# EasyEDA Pro project PCB_SCH_Right_Main.epro

# Schematic right_mains

## Sheets
1 led and buttons: Board Name: right_mains; Create Date: 2025-10-24; Page Name: led and buttons; Project Name: SCH_right_mains; Schematic Name: right_mains; Update Date: 2025-10-23; Add into BOM: yes; Company: Your Company; Convert to PCB: yes; Date: 10/24/2025; Draw By: Habana; REV: 1.0; Sheet: 1/1; spicePre: .
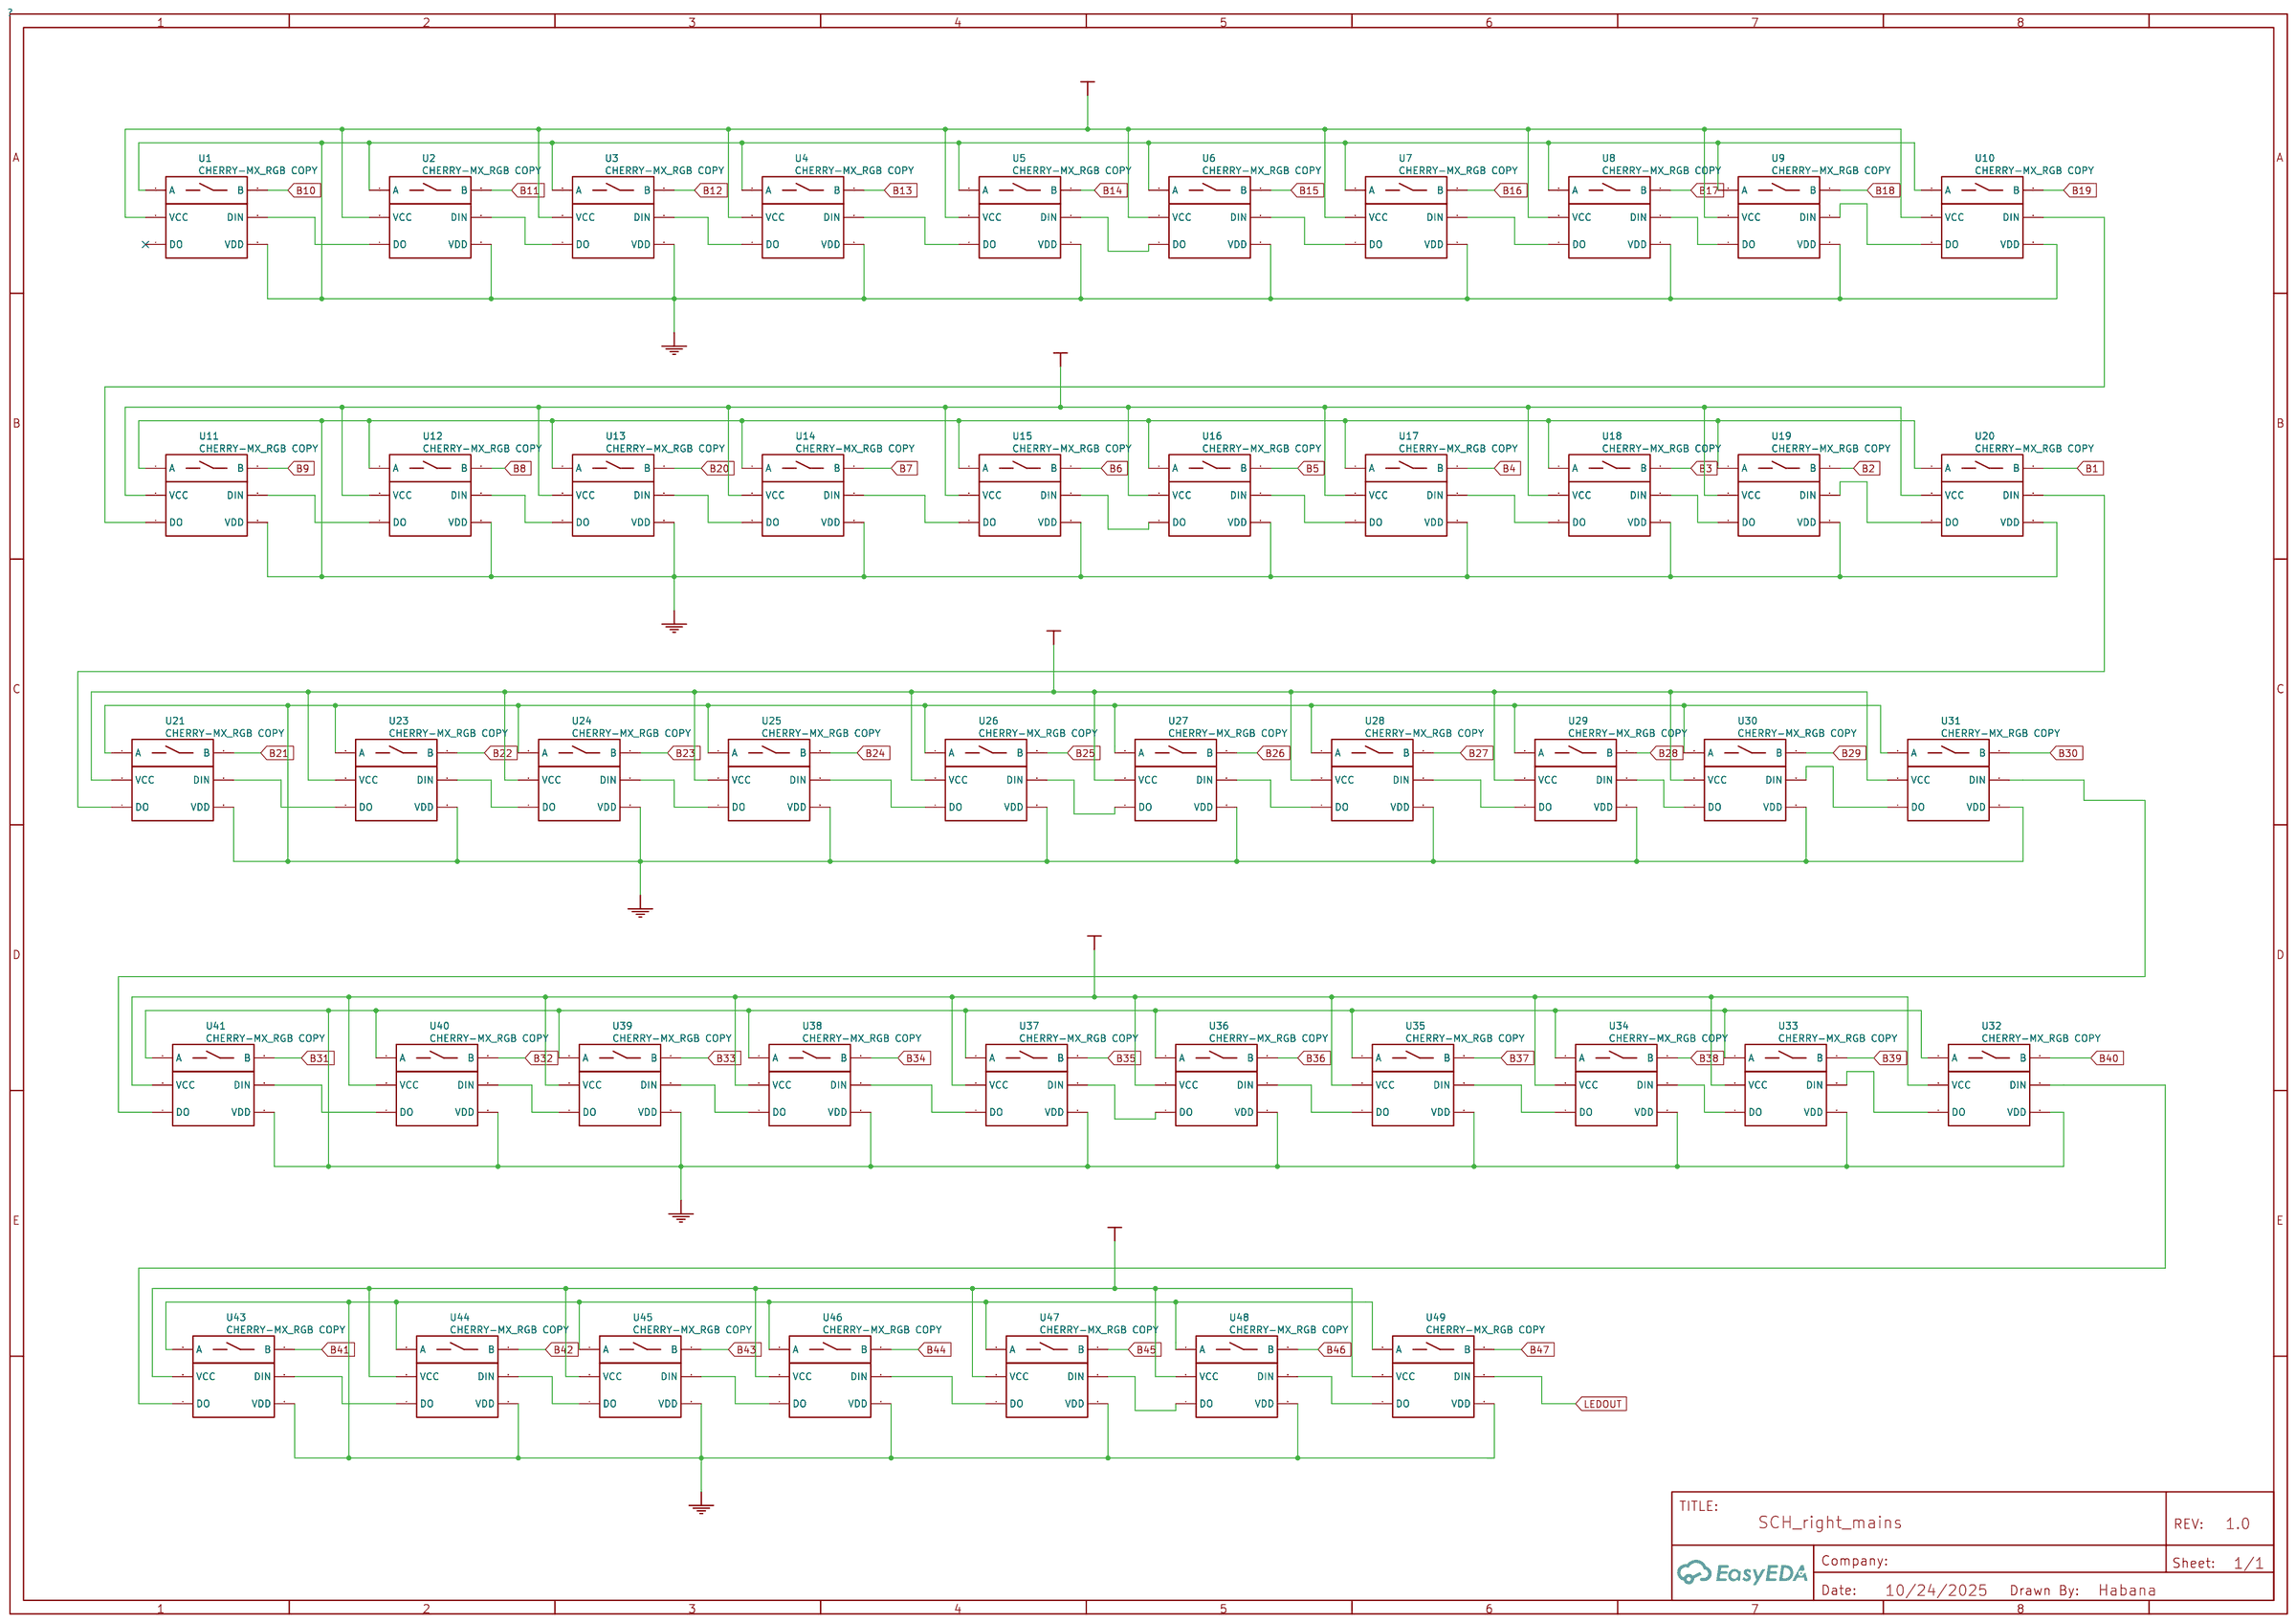
[diagram p0: led and buttons]
2 drivers: Page Name: drivers
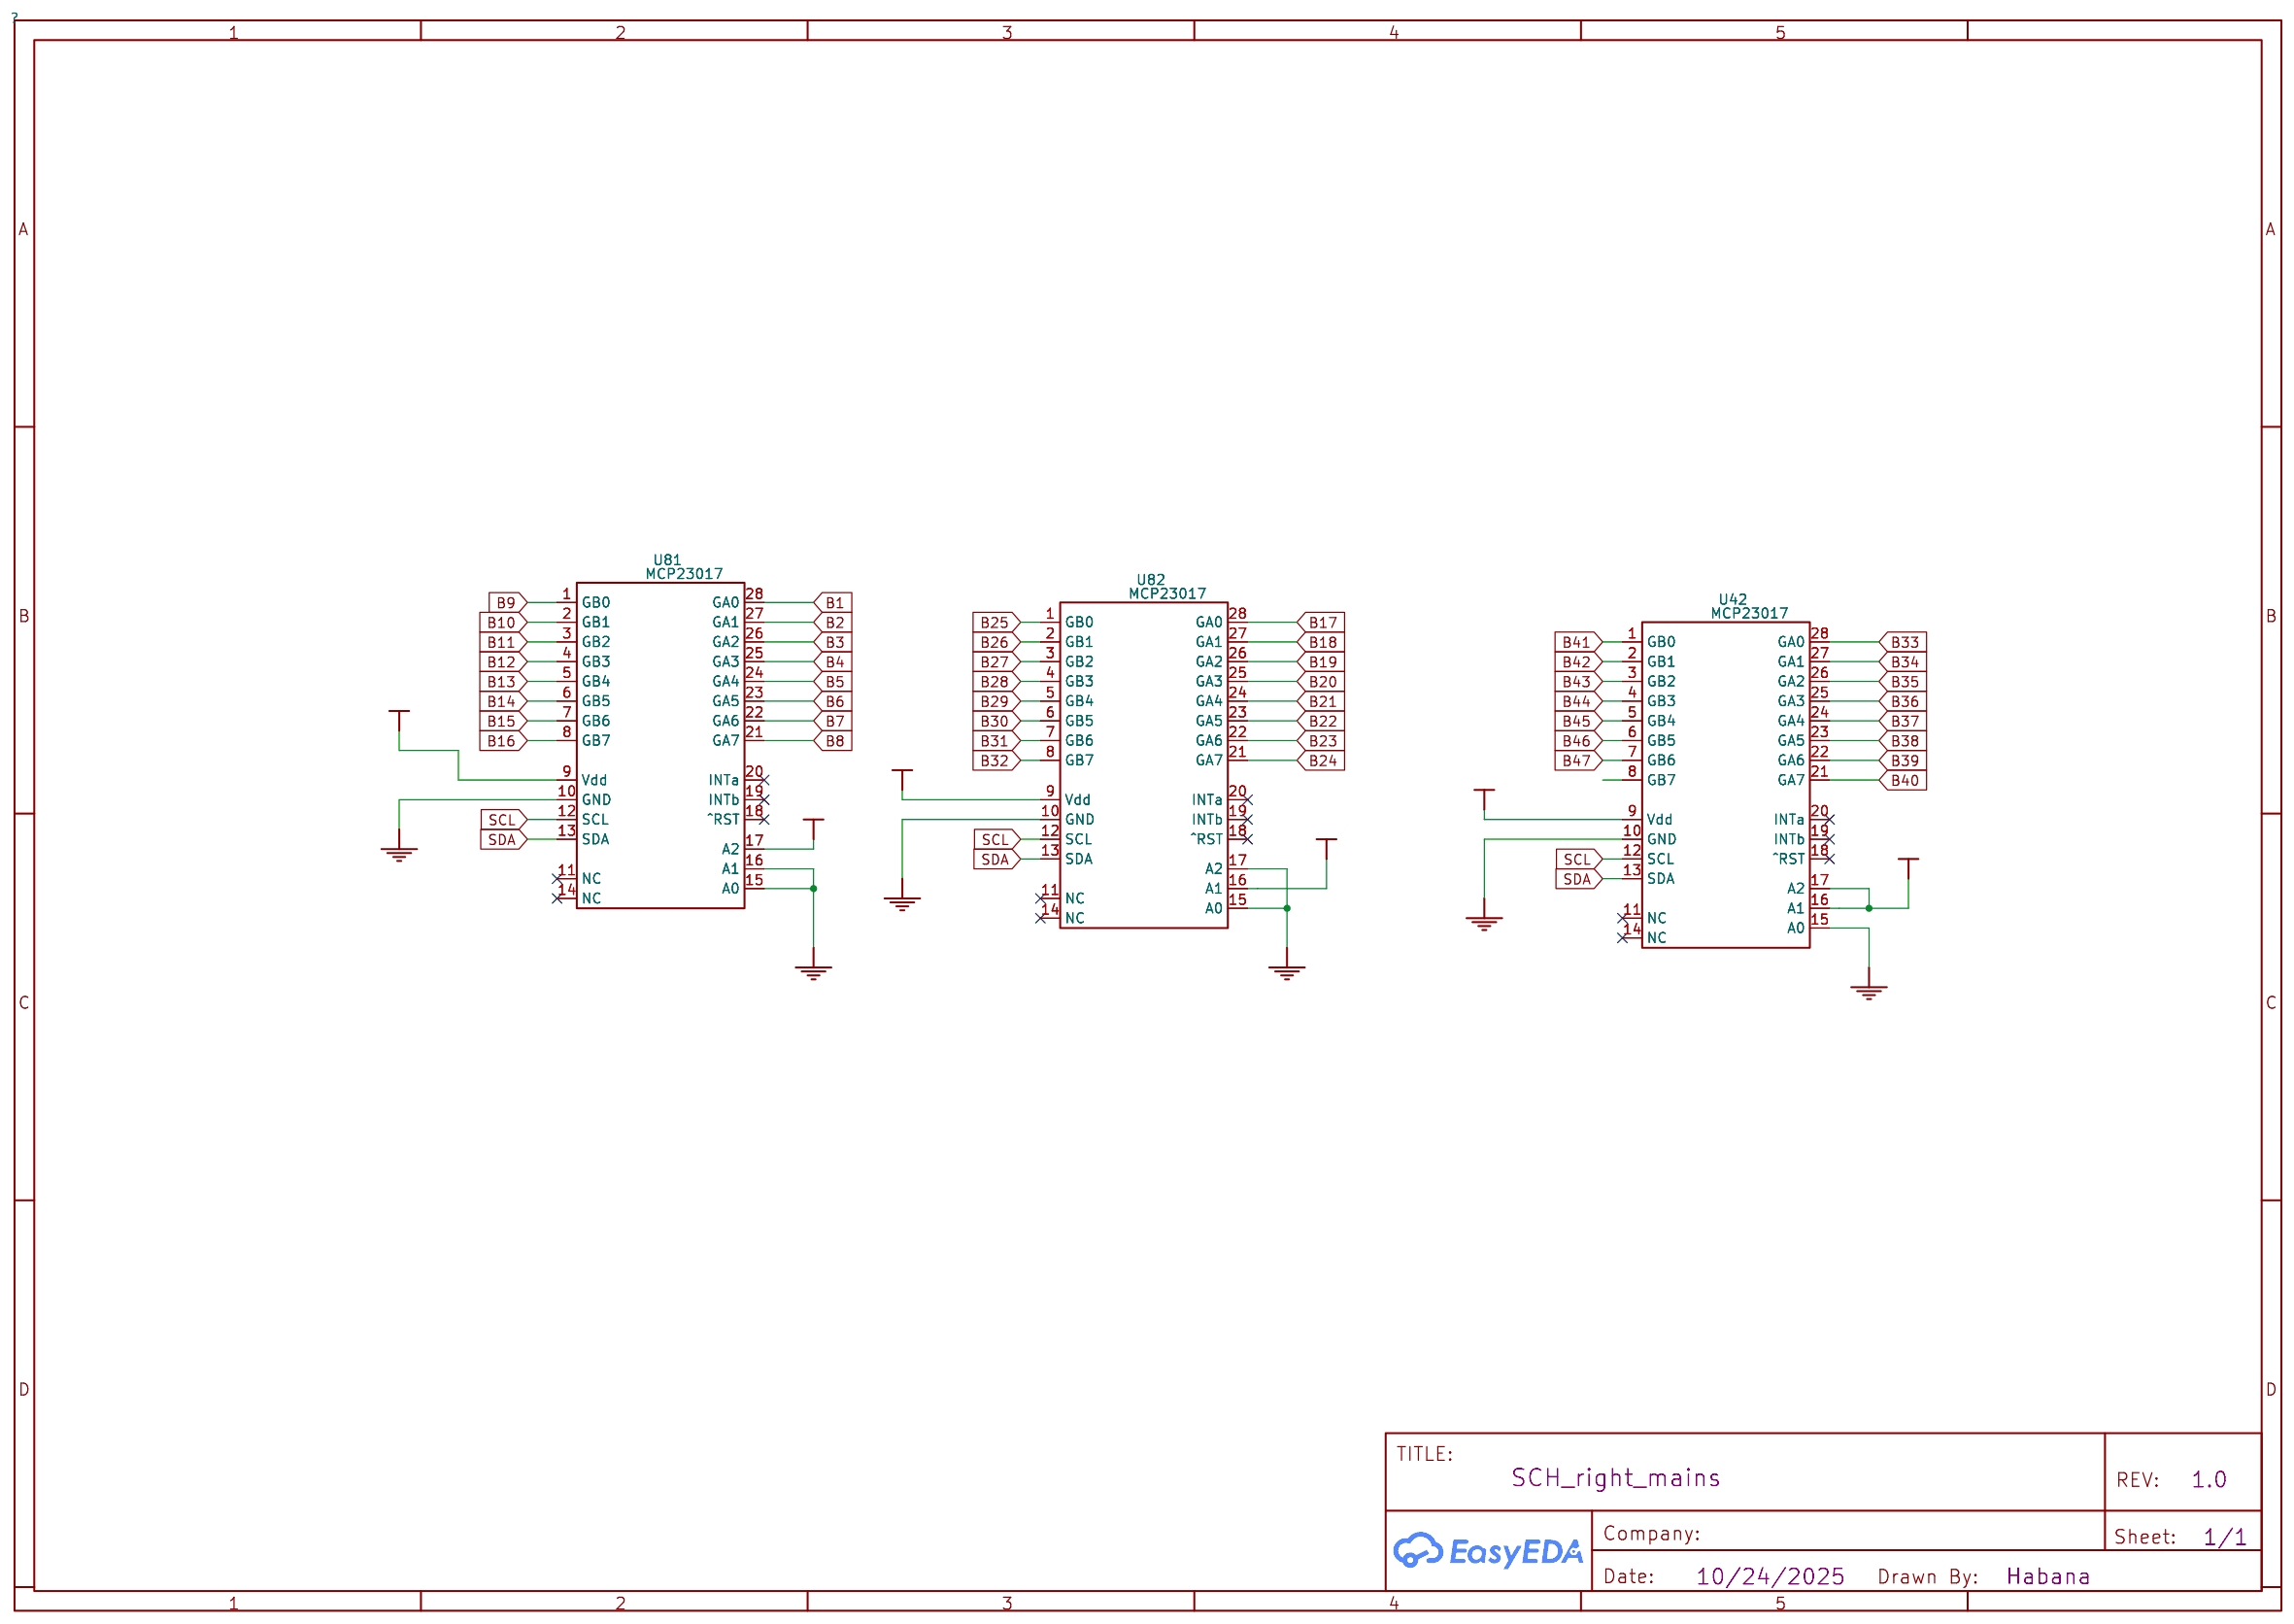
[diagram p1: drivers]
3 micro_controller: Page Name: micro_controller
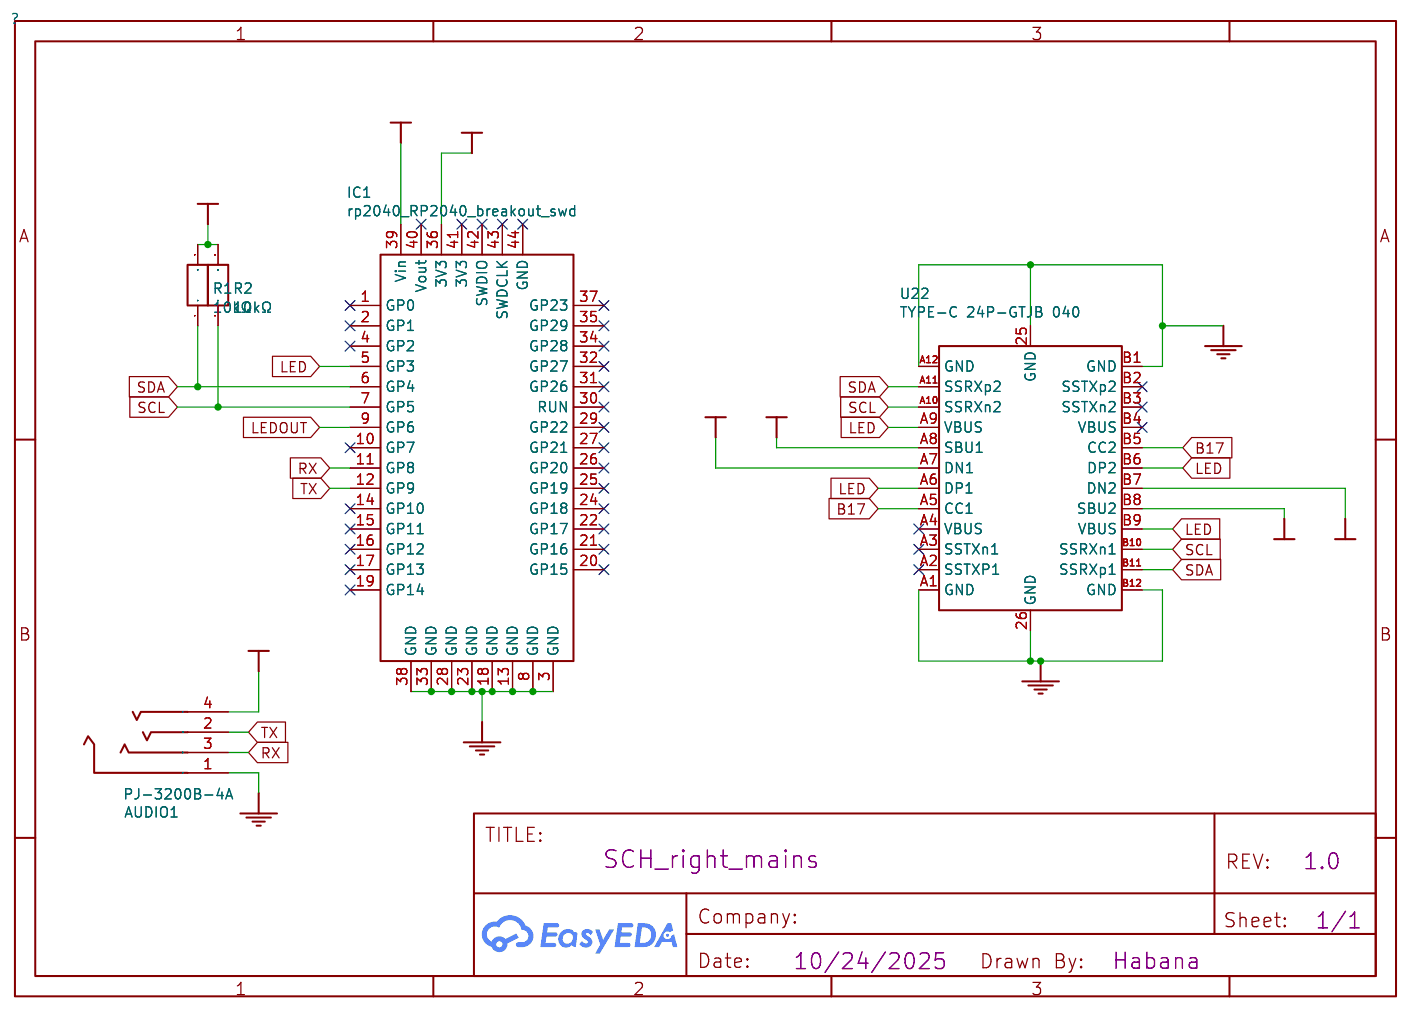
[diagram p2: micro_controller]

## Parts
sheet drivers
U42  MCP23017
U81  MCP23017
U82  MCP23017
sheet led and buttons
U1  CHERRY-MX_RGB COPY
U2  CHERRY-MX_RGB COPY
U3  CHERRY-MX_RGB COPY
U4  CHERRY-MX_RGB COPY
U5  CHERRY-MX_RGB COPY
U6  CHERRY-MX_RGB COPY
U7  CHERRY-MX_RGB COPY
U8  CHERRY-MX_RGB COPY
U9  CHERRY-MX_RGB COPY
U10  CHERRY-MX_RGB COPY
U11  CHERRY-MX_RGB COPY
U12  CHERRY-MX_RGB COPY
U13  CHERRY-MX_RGB COPY
U14  CHERRY-MX_RGB COPY
U15  CHERRY-MX_RGB COPY
U16  CHERRY-MX_RGB COPY
U17  CHERRY-MX_RGB COPY
U18  CHERRY-MX_RGB COPY
U19  CHERRY-MX_RGB COPY
U20  CHERRY-MX_RGB COPY
U21  CHERRY-MX_RGB COPY
U23  CHERRY-MX_RGB COPY
U24  CHERRY-MX_RGB COPY
U25  CHERRY-MX_RGB COPY
U26  CHERRY-MX_RGB COPY
U27  CHERRY-MX_RGB COPY
U28  CHERRY-MX_RGB COPY
U29  CHERRY-MX_RGB COPY
U30  CHERRY-MX_RGB COPY
U31  CHERRY-MX_RGB COPY
U32  CHERRY-MX_RGB COPY
U33  CHERRY-MX_RGB COPY
U34  CHERRY-MX_RGB COPY
U35  CHERRY-MX_RGB COPY
U36  CHERRY-MX_RGB COPY
U37  CHERRY-MX_RGB COPY
U38  CHERRY-MX_RGB COPY
U39  CHERRY-MX_RGB COPY
U40  CHERRY-MX_RGB COPY
U41  CHERRY-MX_RGB COPY
U43  CHERRY-MX_RGB COPY
U44  CHERRY-MX_RGB COPY
U45  CHERRY-MX_RGB COPY
U46  CHERRY-MX_RGB COPY
U47  CHERRY-MX_RGB COPY
U48  CHERRY-MX_RGB COPY
U49  CHERRY-MX_RGB COPY
sheet micro_controller
AUDIO1  PJ-3200B-4A  [AUDIO-TH_PJ-3200B-4A]
IC1  rp2040_RP2040_breakout_swd
R1  10kΩ  [R1206]
R2  10kΩ  [R1206]
U22  TYPE-C 24P-GTJB 040  [USB-C-SMD_TYPE-C-24P-GTJB-040]

## Library data of the parts
U42 U81 U82 = MCP23017: nameAlias: Model; catid: 20; spicePre: X; Contributor: tsvstar
U1-U21 U23-U41 U43-U49 = CHERRY-MX_RGB COPY: Contributor: unrealin01; spicePre: U
AUDIO1 = PJ-3200B-4A: Supplier: LCSC; Manufacturer: 韩国韩荣; Supplier Part: C136687; JLCPCB Part Class: Extended Part; Contributor: LCSC; spicePre: A
IC1 = rp2040_RP2040_breakout_swd: Contributor: rataweb; spicePre: I
R1 R2 = 10kΩ: Supplier: LCSC; Supplier Part: C702863; Manufacturer: HKR(香港电阻); Manufacturer Part: RCT0610KJLF; JLCPCB Part Class: Extended Part; Contributor: LCSC; nameAlias: Value; spicePre: R; spiceSymbolName: RCT0610KJLF
U22 = TYPE-C 24P-GTJB 040: Supplier: LCSC; Supplier Part: C3151751; Manufacturer: SHOU HAN(首韩); JLCPCB Part Class: Extended Part; Contributor: lcsc; spicePre: U

## Nets
+5V: IC1.36(3V3) R1.2 R2.2 U1.3(VCC) U2.3(VCC) U3.3(VCC) U4.3(VCC) U5.3(VCC) U6.3(VCC) U7.3(VCC) U8.3(VCC) U9.3(VCC) U10.3(VCC) U11.3(VCC) U12.3(VCC) U13.3(VCC) U14.3(VCC) U15.3(VCC) U16.3(VCC) U17.3(VCC) U18.3(VCC) U19.3(VCC) U20.3(VCC) U21.3(VCC) U22.A8(SBU1) U22.B8(SBU2) U23.3(VCC) U24.3(VCC) U25.3(VCC) U26.3(VCC) U27.3(VCC) U28.3(VCC) U29.3(VCC) U30.3(VCC) U31.3(VCC) U32.3(VCC) U33.3(VCC) U34.3(VCC) U35.3(VCC) U36.3(VCC) U37.3(VCC) U38.3(VCC) U39.3(VCC) U40.3(VCC) U41.3(VCC) U43.3(VCC) U44.3(VCC) U45.3(VCC) U46.3(VCC) U47.3(VCC) U48.3(VCC) U49.3(VCC)
GND: AUDIO1.1 IC1.3(GND) IC1.8(GND) IC1.13(GND) IC1.18(GND) IC1.23(GND) IC1.28(GND) IC1.33(GND) IC1.38(GND) U1.1(A) U1.5(VDD) U2.1(A) U2.5(VDD) U3.1(A) U3.5(VDD) U4.1(A) U4.5(VDD) U5.1(A) U5.5(VDD) U6.1(A) U6.5(VDD) U7.1(A) U7.5(VDD) U8.1(A) U8.5(VDD) U9.1(A) U9.5(VDD) U10.1(A) U10.5(VDD) U11.1(A) U11.5(VDD) U12.1(A) U12.5(VDD) U13.1(A) U13.5(VDD) U14.1(A) U14.5(VDD) U15.1(A) U15.5(VDD) U16.1(A) U16.5(VDD) U17.1(A) U17.5(VDD) U18.1(A) U18.5(VDD) U19.1(A) U19.5(VDD) U20.1(A) U20.5(VDD) U21.1(A) U21.5(VDD) U22.25(GND) U22.26(GND) U22.A1(GND) U22.A12(GND) U22.B1(GND) U22.B12(GND) U23.1(A) U23.5(VDD) U24.1(A) U24.5(VDD) U25.1(A) U25.5(VDD) U26.1(A) U26.5(VDD) U27.1(A) U27.5(VDD) U28.1(A) U28.5(VDD) U29.1(A) U29.5(VDD) U30.1(A) U30.5(VDD) U31.1(A) U31.5(VDD) U32.1(A) U32.5(VDD) U33.1(A) U33.5(VDD) U34.1(A) U34.5(VDD) U35.1(A) U35.5(VDD) U36.1(A) U36.5(VDD) U37.1(A) U37.5(VDD) U38.1(A) U38.5(VDD) U39.1(A) U39.5(VDD) U40.1(A) U40.5(VDD) U41.1(A) U41.5(VDD) U42.10(GND) U42.15(A0) U43.1(A) U43.5(VDD) U44.1(A) U44.5(VDD) U45.1(A) U45.5(VDD) U46.1(A) U46.5(VDD) U47.1(A) U47.5(VDD) U48.1(A) U48.5(VDD) U49.1(A) U49.5(VDD) U81.10(GND) U81.15(A0) U81.16(A1) U82.10(GND) U82.15(A0) U82.17(A2)
VCC: AUDIO1.4 IC1.39(Vin) U22.A7(DN1) U22.B7(DN2) U42.9(Vdd) U42.16(A1) U42.17(A2) U81.9(Vdd) U81.17(A2) U82.9(Vdd) U82.16(A1)
B1: U20.2(B) U81.28(GA0)
B2: U19.2(B) U81.27(GA1)
B3: U18.2(B) U81.26(GA2)
B4: U17.2(B) U81.25(GA3)
B5: U16.2(B) U81.24(GA4)
B6: U15.2(B) U81.23(GA5)
B7: U14.2(B) U81.22(GA6)
B8: U12.2(B) U81.21(GA7)
B9: U11.2(B) U81.1(GB0)
B10: U1.2(B) U81.2(GB1)
B11: U2.2(B) U81.3(GB2)
B12: U3.2(B) U81.4(GB3)
B13: U4.2(B) U81.5(GB4)
B14: U5.2(B) U81.6(GB5)
B15: U6.2(B) U81.7(GB6)
B16: U7.2(B) U81.8(GB7)
B17: U8.2(B) U22.A5(CC1) U22.B5(CC2) U82.28(GA0)
B18: U9.2(B) U82.27(GA1)
B19: U10.2(B) U82.26(GA2)
B20: U13.2(B) U82.25(GA3)
B21: U21.2(B) U82.24(GA4)
B22: U23.2(B) U82.23(GA5)
B23: U24.2(B) U82.22(GA6)
B24: U25.2(B) U82.21(GA7)
B25: U26.2(B) U82.1(GB0)
B26: U27.2(B) U82.2(GB1)
B27: U28.2(B) U82.3(GB2)
B28: U29.2(B) U82.4(GB3)
B29: U30.2(B) U82.5(GB4)
B30: U31.2(B) U82.6(GB5)
B31: U41.2(B) U82.7(GB6)
B32: U40.2(B) U82.8(GB7)
B33: U39.2(B) U42.28(GA0)
B34: U38.2(B) U42.27(GA1)
B35: U37.2(B) U42.26(GA2)
B36: U36.2(B) U42.25(GA3)
B37: U35.2(B) U42.24(GA4)
B38: U34.2(B) U42.23(GA5)
B39: U33.2(B) U42.22(GA6)
B40: U32.2(B) U42.21(GA7)
B41: U42.1(GB0) U43.2(B)
B42: U42.2(GB1) U44.2(B)
B43: U42.3(GB2) U45.2(B)
B44: U42.4(GB3) U46.2(B)
B45: U42.5(GB4) U47.2(B)
B46: U42.6(GB5) U48.2(B)
B47: U42.7(GB6) U49.2(B)
LED: IC1.5(GP3) U22.A6(DP1) U22.A9(VBUS) U22.B6(DP2) U22.B9(VBUS)
LEDOUT: IC1.9(GP6) U49.6(DIN)
RX: AUDIO1.3 IC1.11(GP8)
SCL: IC1.7(GP5) R2.1 U22.A10(SSRXn2) U22.B10(SSRXn1) U42.12(SCL) U81.12(SCL) U82.12(SCL)
SDA: IC1.6(GP4) R1.1 U22.A11(SSRXp2) U22.B11(SSRXp1) U42.13(SDA) U81.13(SDA) U82.13(SDA)
TX: AUDIO1.2 IC1.12(GP9)
U1_6: U1.6(DIN) U2.4(DO)
U2_6: U2.6(DIN) U3.4(DO)
U3_6: U3.6(DIN) U4.4(DO)
U4_6: U4.6(DIN) U5.4(DO)
U5_6: U5.6(DIN) U6.4(DO)
U6_6: U6.6(DIN) U7.4(DO)
U7_6: U7.6(DIN) U8.4(DO)
U8_6: U8.6(DIN) U9.4(DO)
U9_6: U9.6(DIN) U10.4(DO)
U10_6: U10.6(DIN) U11.4(DO)
U11_6: U11.6(DIN) U12.4(DO)
U12_6: U12.6(DIN) U13.4(DO)
U13_6: U13.6(DIN) U14.4(DO)
U14_6: U14.6(DIN) U15.4(DO)
U15_6: U15.6(DIN) U16.4(DO)
U16_6: U16.6(DIN) U17.4(DO)
U17_6: U17.6(DIN) U18.4(DO)
U18_6: U18.6(DIN) U19.4(DO)
U19_6: U19.6(DIN) U20.4(DO)
U20_6: U20.6(DIN) U21.4(DO)
U21_6: U21.6(DIN) U23.4(DO)
U23_6: U23.6(DIN) U24.4(DO)
U24_6: U24.6(DIN) U25.4(DO)
U25_6: U25.6(DIN) U26.4(DO)
U26_6: U26.6(DIN) U27.4(DO)
U27_6: U27.6(DIN) U28.4(DO)
U28_6: U28.6(DIN) U29.4(DO)
U29_6: U29.6(DIN) U30.4(DO)
U30_6: U30.6(DIN) U31.4(DO)
U31_6: U31.6(DIN) U41.4(DO)
U32_4: U32.4(DO) U33.6(DIN)
U32_6: U32.6(DIN) U43.4(DO)
U33_4: U33.4(DO) U34.6(DIN)
U34_4: U34.4(DO) U35.6(DIN)
U35_4: U35.4(DO) U36.6(DIN)
U36_4: U36.4(DO) U37.6(DIN)
U37_4: U37.4(DO) U38.6(DIN)
U38_4: U38.4(DO) U39.6(DIN)
U39_4: U39.4(DO) U40.6(DIN)
U40_4: U40.4(DO) U41.6(DIN)
U43_6: U43.6(DIN) U44.4(DO)
U44_6: U44.6(DIN) U45.4(DO)
U45_6: U45.6(DIN) U46.4(DO)
U46_6: U46.6(DIN) U47.4(DO)
U47_6: U47.6(DIN) U48.4(DO)
U48_6: U48.6(DIN) U49.4(DO)

Not connected (* = marked no-connect by the designer): IC1 1(GP0)* 2(GP1)* 4(GP2)* 10(GP7)* 14(GP10)* 15(GP11)* 16(GP12)* 17(GP13)* 19(GP14)* 20(GP15)* 21(GP16)* 22(GP17)* 24(GP18)* 25(GP19)* 26(GP20)* 27(GP21)* 29(GP22)* 30(RUN)* 31(GP26)* 32(GP27)* 34(GP28)* 35(GP29)* 37(GP23)* 40(Vout)* 41(3V3)* 42(SWDIO)* 43(SWDCLK)* 44(GND)*; U1 4(DO)*; U22 A2(SSTXP1)* A3(SSTXn1)* A4(VBUS)* B2(SSTXp2)* B3(SSTXn2)* B4(VBUS)*; U42 8(GB7) 11(NC)* 14(NC)* 18(^RST)* 19(INTb)* 20(INTa)*; U81 11(NC)* 14(NC)* 18(^RST)* 19(INTb)* 20(INTa)*; U82 11(NC)* 14(NC)* 18(^RST)* 19(INTb)* 20(INTa)*

# Board PCB_PCB_right_mains
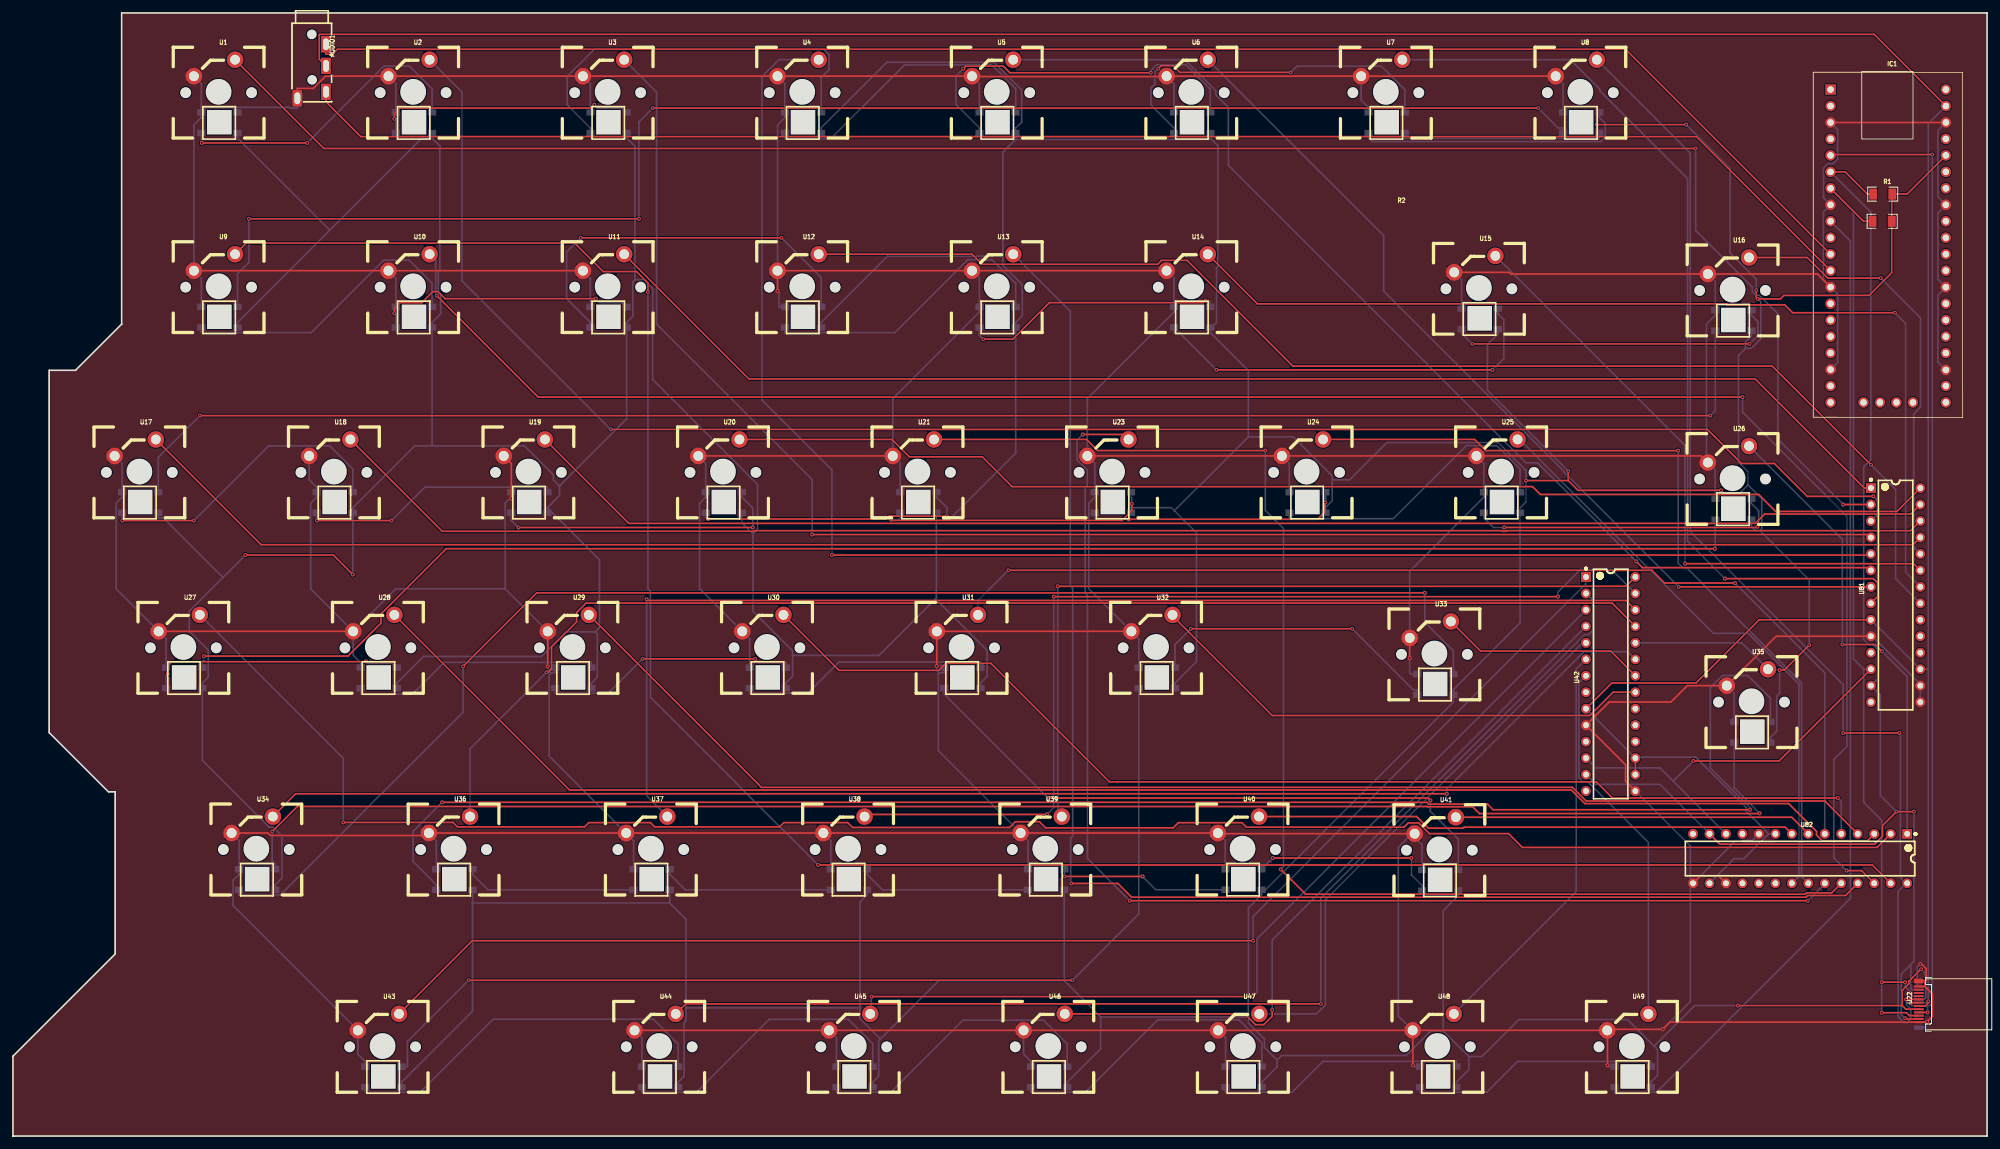
[diagram p3: board, top side]
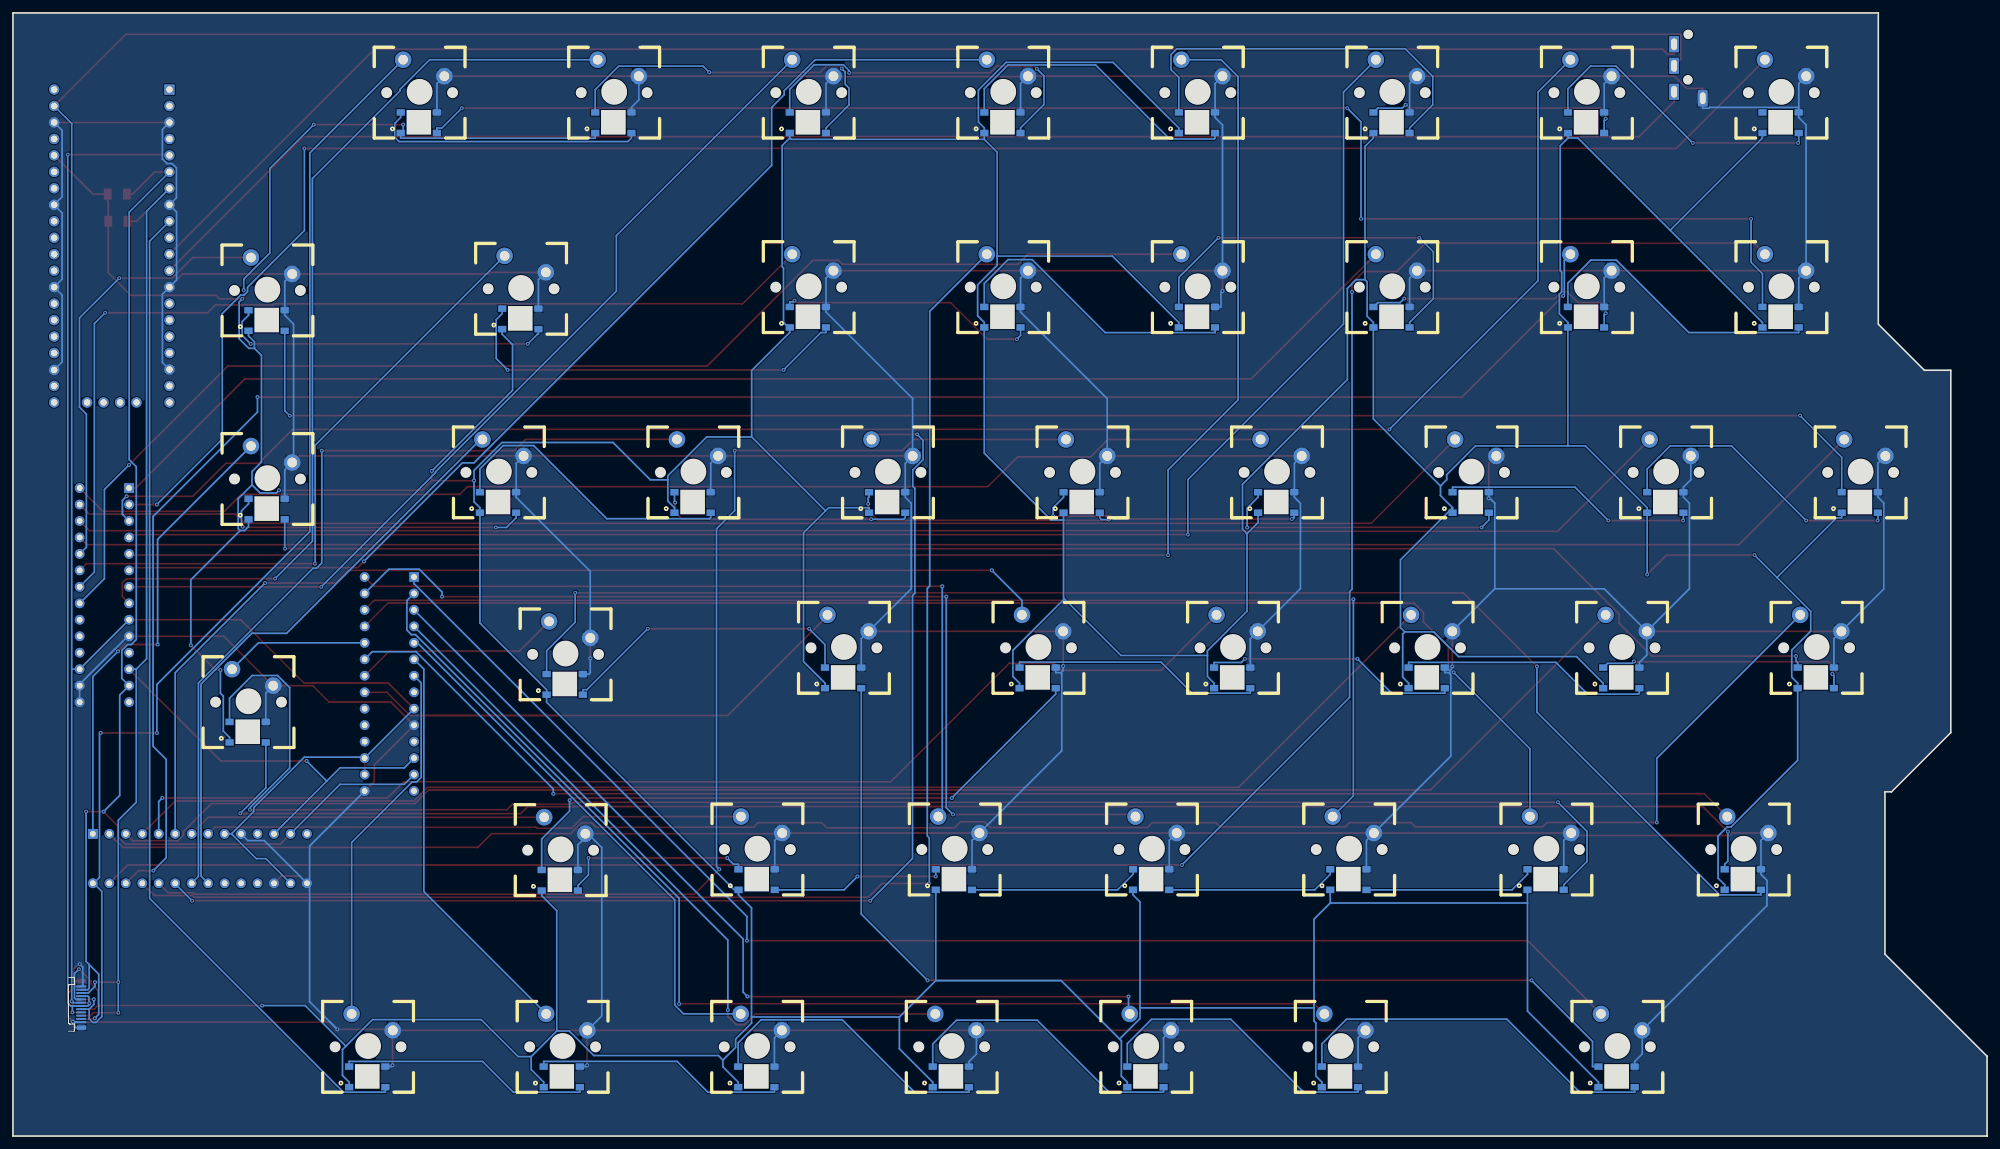
[diagram p4: board, bottom side, seen from below]

Outline 304.42 x 173.23 mm; copper layers: Top Layer, Bottom Layer. Coordinates in mm from the lower left corner of the outline.
Outline path: 0,0 0,12.32 15.75,28.07 15.75,53.09 14.73,53.09 5.59,62.23 5.59,118.11 9.65,118.11 16.76,125.22 16.76,173.23 304.42,173.23 304.42,0 0,0 ; 0,0 0.13,0
Stack: Top Layer 0.035mm / Dielectric1 1.51mm FR4 er 4.5 / Bottom Layer 0.035mm

## Design rules (mm)
spacing Default (default): track to track 0.152, other pairs 0 to 0.152
track width Default (default): min 0.254, default 0.254, max 25.4
differential pair differentialPair (default): width min 0.127, default 0.254, max 2.54; gap min 0.152, default 0.152
via Default (default): diameter min 0.61, default 0.61, max 100.025; hole min 0.305, default 0.305, max 59.995
pour e1030 uses gge187749
pour e1492 uses gge187722

## Placement (name value [footprint] x y rotation side)
AUDIO1  PJ-3200B-4A  [AUDIO-TH_PJ-3200B-4A]  46.06 164.23 270 top
IC1  rp2040_RP2040_breakout_swd  [RP2040:RP2040-BREAKOUT_SWD]  289.18 137.29 0 top
R1  10kΩ  [R1206]  288.34 145.29 0 top
R2  10kΩ  [R1206]  288.25 141.1 0 top
U1  CHERRY-MX_RGB COPY  [CHERRY-MX-RGB]  33.74 154.08 0 top
U2  CHERRY-MX_RGB COPY  [CHERRY-MX-RGB]  63.74 154.08 0 top
U3  CHERRY-MX_RGB COPY  [CHERRY-MX-RGB]  93.74 154.08 0 top
U4  CHERRY-MX_RGB COPY  [CHERRY-MX-RGB]  123.74 154.08 0 top
U5  CHERRY-MX_RGB COPY  [CHERRY-MX-RGB]  153.74 154.08 0 top
U6  CHERRY-MX_RGB COPY  [CHERRY-MX-RGB]  183.74 154.08 0 top
U7  CHERRY-MX_RGB COPY  [CHERRY-MX-RGB]  213.74 154.08 0 top
U8  CHERRY-MX_RGB COPY  [CHERRY-MX-RGB]  243.74 154.08 0 top
U9  CHERRY-MX_RGB COPY  [CHERRY-MX-RGB]  33.74 124.08 0 top
U10  CHERRY-MX_RGB COPY  [CHERRY-MX-RGB]  63.74 124.08 0 top
U11  CHERRY-MX_RGB COPY  [CHERRY-MX-RGB]  93.74 124.08 0 top
U12  CHERRY-MX_RGB COPY  [CHERRY-MX-RGB]  123.74 124.08 0 top
U13  CHERRY-MX_RGB COPY  [CHERRY-MX-RGB]  153.74 124.08 0 top
U14  CHERRY-MX_RGB COPY  [CHERRY-MX-RGB]  183.74 124.08 0 top
U15  CHERRY-MX_RGB COPY  [CHERRY-MX-RGB]  228.09 123.83 0 top
U16  CHERRY-MX_RGB COPY  [CHERRY-MX-RGB]  267.21 123.57 0 top
U17  CHERRY-MX_RGB COPY  [CHERRY-MX-RGB]  21.52 95.5 0 top
U18  CHERRY-MX_RGB COPY  [CHERRY-MX-RGB]  51.52 95.5 0 top
U19  CHERRY-MX_RGB COPY  [CHERRY-MX-RGB]  81.52 95.5 0 top
U20  CHERRY-MX_RGB COPY  [CHERRY-MX-RGB]  111.52 95.5 0 top
U21  CHERRY-MX_RGB COPY  [CHERRY-MX-RGB]  141.52 95.5 0 top
U22  TYPE-C 24P-GTJB 040  [USB-C-SMD_TYPE-C-24P-GTJB-040]  293.88 20.32 90 top
U23  CHERRY-MX_RGB COPY  [CHERRY-MX-RGB]  171.52 95.5 0 top
U24  CHERRY-MX_RGB COPY  [CHERRY-MX-RGB]  201.52 95.5 0 top
U25  CHERRY-MX_RGB COPY  [CHERRY-MX-RGB]  231.52 95.5 0 top
U26  CHERRY-MX_RGB COPY  [CHERRY-MX-RGB]  267.21 94.49 0 top
U27  CHERRY-MX_RGB COPY  [CHERRY-MX-RGB]  28.31 68.45 0 top
U28  CHERRY-MX_RGB COPY  [CHERRY-MX-RGB]  58.31 68.45 0 top
U29  CHERRY-MX_RGB COPY  [CHERRY-MX-RGB]  88.31 68.45 0 top
U30  CHERRY-MX_RGB COPY  [CHERRY-MX-RGB]  118.31 68.45 0 top
U31  CHERRY-MX_RGB COPY  [CHERRY-MX-RGB]  148.31 68.45 0 top
U32  CHERRY-MX_RGB COPY  [CHERRY-MX-RGB]  178.31 68.45 0 top
U33  CHERRY-MX_RGB COPY  [CHERRY-MX-RGB]  221.23 67.44 0 top
U34  CHERRY-MX_RGB COPY  [CHERRY-MX-RGB]  39.56 37.34 0 top
U35  CHERRY-MX_RGB COPY  [CHERRY-MX-RGB]  270.13 60.07 0 top
U36  CHERRY-MX_RGB COPY  [CHERRY-MX-RGB]  69.98 37.34 0 top
U37  CHERRY-MX_RGB COPY  [CHERRY-MX-RGB]  100.39 37.34 0 top
U38  CHERRY-MX_RGB COPY  [CHERRY-MX-RGB]  130.81 37.34 0 top
U39  CHERRY-MX_RGB COPY  [CHERRY-MX-RGB]  161.23 37.34 0 top
U40  CHERRY-MX_RGB COPY  [CHERRY-MX-RGB]  191.64 37.34 0 top
U41  CHERRY-MX_RGB COPY  [CHERRY-MX-RGB]  222 37.24 0 top
U42  MCP23017  [DIP-28_300MIL]  246.38 69.72 90 top
U43  CHERRY-MX_RGB COPY  [CHERRY-MX-RGB]  59.03 6.9 0 top
U44  CHERRY-MX_RGB COPY  [CHERRY-MX-RGB]  101.69 6.9 0 top
U45  CHERRY-MX_RGB COPY  [CHERRY-MX-RGB]  131.69 6.9 0 top
U46  CHERRY-MX_RGB COPY  [CHERRY-MX-RGB]  161.69 6.9 0 top
U47  CHERRY-MX_RGB COPY  [CHERRY-MX-RGB]  191.69 6.9 0 top
U48  CHERRY-MX_RGB COPY  [CHERRY-MX-RGB]  221.69 6.9 0 top
U49  CHERRY-MX_RGB COPY  [CHERRY-MX-RGB]  251.69 6.9 0 top
U81  MCP23017  [DIP-28_300MIL]  290.32 83.44 90 top
U82  MCP23017  [DIP-28_300MIL]  275.59 42.8 0 top

## Footprints (pads in the part's own frame, mm; a bottom-side part is the same pattern mirrored in y, then rotated)
AUDIO-TH_PJ-3200B-4A
  rect 2.5x1.5 hole 1.8x0.9: 1(4.17,-2.204) 2(3.17,2.204) 3(-4.17,2.204) 4(-0.831,2.204)
CHERRY-MX-RGB
  round 2.54 hole 1.524: 1(-5.842,9.398)
  round 2.54 hole 1.5: 2(0.508,11.938)
  rect 1.27x1 smd far side: 3(0.889,0.635) 4(0.889,3.81) 5(-4.699,3.81) 6(-4.699,0.635)
DIP-28_300MIL
  rect 1.5x1.5 hole 0.9: 1(16.51,3.81)
  round 1.5 hole 0.9: 2(13.97,3.81) 3(11.43,3.81) 4(8.89,3.81) 5(6.35,3.81) 6(3.81,3.81) 7(1.27,3.81) 8(-1.27,3.81) 9(-3.81,3.81) 10(-6.35,3.81) 11(-8.89,3.81) 12(-11.43,3.81) 13(-13.97,3.81) 14(-16.51,3.81) 15(-16.51,-3.81) 16(-13.97,-3.81) 17(-11.43,-3.81) 18(-8.89,-3.81) 19(-6.35,-3.81) 20(-3.81,-3.81) 21(-1.27,-3.81) 22(1.27,-3.81) 23(3.81,-3.81) 24(6.35,-3.81) 25(8.89,-3.81) 26(11.43,-3.81) 27(13.97,-3.81) 28(16.51,-3.81)
R1206
  rect 1.208x1.701 smd: 1(-1.479,0) 2(1.479,0)
RP2040:RP2040-BREAKOUT_SWD
  rect 1.6x1.6 hole 1.005x1: 1(-8.89,24.13)
  round 1.6 hole 1.005x1: 2(-8.89,21.59) 3(-8.89,19.05) 4(-8.89,16.51) 5(-8.89,13.97) 6(-8.89,11.43) 7(-8.89,8.89) 8(-8.89,6.35) 9(-8.89,3.81) 10(-8.89,1.27) 11(-8.89,-1.27) 12(-8.89,-3.81) 13(-8.89,-6.35) 14(-8.89,-8.89) 15(-8.89,-11.43) 16(-8.89,-13.97) 17(-8.898,-16.506) 18(-8.89,-19.05) 19(-8.89,-21.59) 20(-8.89,-24.13) 21(8.89,-24.13) 22(8.89,-21.59) 23(8.89,-19.122) 24(8.89,-16.51) 25(8.89,-13.97) 26(8.89,-11.43) 27(8.89,-8.89) 28(8.89,-6.35) 29(8.89,-3.81) 30(8.89,-1.27) 31(8.89,1.27) 32(8.89,3.81) 33(8.89,6.35) 34(8.89,8.89) 35(8.89,11.43) 36(8.89,13.97) 37(8.89,16.51) 38(8.89,19.05) 39(8.89,21.59) 40(8.89,24.13) 41(-3.81,-24.13) 42(-1.27,-24.13) 43(1.27,-24.13) 44(3.81,-24.13)
USB-C-SMD_TYPE-C-24P-GTJB-040
  rect 0.7x1.4 smd: 25(3.6,0.025)
  rect 0.7x1.4 smd far side: 26(-3.6,0.025)
  rect 0.3x1.5 smd: A1(2.75,-0.025) A2(2.25,-0.025) A3(1.75,-0.025) A4(1.25,-0.025) A5(0.75,-0.025) A6(0.25,-0.025) A7(-0.25,-0.025) A8(-0.75,-0.025) A9(-1.25,-0.025) A10(-1.75,-0.025) A11(-2.25,-0.025) A12(-2.75,-0.025)
  rect 0.3x1.5 smd far side: B1(-2.75,-0.025) B2(-2.25,-0.025) B3(-1.75,-0.025) B4(-1.25,-0.025) B5(-0.75,-0.025) B6(-0.25,-0.025) B7(0.25,-0.025) B8(0.75,-0.025) B9(1.25,-0.025) B10(1.75,-0.025) B11(2.25,-0.025) B12(2.75,-0.025)

## Nets
As in the schematic.

Pads without a net: IC1 1 2 4 10 14 15 16 17 19 20 21 22 24 25 26 27 29 30 31 32 34 35 37 40 41 42 43 44; U1 4; U22 A2 A3 A4 B2 B3 B4; U42 8 11 14 18 19 20; U81 11 14 18 19 20; U82 11 14 18 19 20

## Via types
v1: diameter 0.61, hole 0.305, Top Layer to Bottom Layer, 140 vias

## Routing (per net, layer and track width the routed paths; a pad name or vN(x,y) marks a point on that pad's centre or on a via; arc(x,y) is an arc through that point)
+5V: length 1652.4
  Top Layer w0.254: IC1.36 292.1,145.29 R1.2 289.81,144.16 289.72,144.07 R2.2 289.72,133.16 286.23,129.67 273.09,129.67 272.55,129.12 v1(269.05,129.12) 268.83,129.35 v1(268.83,130.48) ; v1(35.85,89.61) 49.41,89.61 v1(52.41,86.61) ; 239.84,101.11 v1(239.84,102.58) ; 239.84,101.11 v1(233.33,101.11) ; 239.84,101.11 241.34,99.6 v1(263.39,99.6) ; 291.34,20.13 291.34,22.46 292.36,23.49 292.36,23.88 294.21,25.72 v1(294.25,25.72) ; 291.34,20.13 v1(265.99,20.13) ; 291.34,20.13 291.89,19.57 U22.A8 ; v1(272.43,71.88) 273.16,71.88 v1(276.99,75.71) ; v1(244.24,156.01) v1(258.03,156.01)
  Bottom Layer w0.254: 267.55,100.43 267.55,102.5 266.09,103.95 266.09,120.42 267.18,121.5 ; 267.55,100.43 269.69,98.3 269.69,93.7 269.39,93.4 ; 267.55,100.43 266.31,99.2 263.79,99.2 v1(263.39,99.6) ; 203.44,101.22 206.12,101.22 211.88,106.98 229.01,106.98 233.33,102.66 v1(233.33,101.11) 233.33,97.83 232.41,96.92 U25.3 232.41,79.14 222.12,68.85 222.12,66.93 192.78,37.58 192.53,37.58 ; 203.44,101.22 203.44,101.83 197.43,107.83 190.5,107.83 ; 203.44,101.22 203.44,97.94 202.41,96.92 U24.3 ; 48.85,139.71 34.63,153.93 U1.3 ; 48.85,139.71 34.63,125.49 U9.3 ; 48.85,139.71 63.07,153.93 64.63,153.93 ; 149.2,69.08 149.2,69.86 150.22,70.89 150.22,74.91 142.28,82.85 ; 184.63,153.93 185.8,152.76 185.8,134.11 185.6,133.91 185.6,125.5 184.63,124.53 ; 184.63,153.93 184.42,153.73 154.63,153.73 ; 184.63,153.93 U6.3 ; 84.28,100.27 84.28,98.79 82.41,96.92 ; 84.28,100.27 83.33,101.23 ; 84.28,100.27 94.63,110.62 U11.3 94.63,125.49 95.6,126.46 95.6,131.76 95.92,132.08 ; U14.3 184.63,124.53 ; 184.63,124.53 184.63,123.93 190.5,118.06 190.5,107.83 ; 133.77,14.97 142.77,23.97 162.12,23.97 ; 133.77,14.97 133.49,14.7 133.49,9.23 132.58,8.32 U45.3 ; 133.77,14.97 130.62,18.12 130.62,19.76 ; 152.65,135.73 152.65,151.75 154.63,153.73 ; 152.65,135.73 152.65,134.3 155.66,131.3 155.66,126.52 154.63,125.49 U13.3 154.63,105.33 144.33,95.03 142.41,95.03 ; 152.65,135.73 134.87,135.73 124.63,125.49 U12.3 ; 101.28,35.94 70.87,35.94 ; 101.28,35.94 U37.3 ; 101.28,35.94 103.78,33.45 103.78,19.76 ; 70.87,35.94 70.87,19.26 59.92,8.32 U43.3 ; 70.87,35.94 U36.3 ; U49.3 252.58,8.32 253.61,9.34 253.61,13.34 253.08,13.86 ; 82.41,96.92 90.44,88.88 90.44,78.42 89.79,77.76 ; 82.41,96.92 U19.3 ; 253.08,13.86 248.98,17.96 232.23,17.96 226.52,12.25 224.51,12.25 ; 253.08,13.86 259.35,20.13 v1(265.99,20.13) ; U26.3 268.09,94 268.7,93.4 269.39,93.4 ; 267.18,121.5 268.05,121.5 269.53,122.98 269.53,128.64 v1(269.05,129.12) ; 267.18,121.5 267.18,122.51 268.1,123.43 U16.3 ; 167.72,18.36 167.72,13.46 162.58,8.32 162.58,7.54 ; 167.72,18.36 190.52,18.36 ; 167.72,18.36 162.12,23.97 ; 162.12,23.97 U39.3 ; 130.62,19.76 130.62,36.11 131.7,37.19 U38.3 ; 130.62,19.76 103.78,19.76 ; v1(294.25,25.72) 294.93,25.04 294.93,21.3 294.7,21.07 U22.B8 ; 64.63,106.45 U10.3 64.63,125.49 65.95,126.82 65.95,129.84 65.6,130.2 65.6,133.25 65.82,133.48 65.82,152.74 64.63,153.93 ; 64.63,106.45 78.88,106.45 83.33,102 83.33,101.23 ; 64.63,106.45 61.95,106.45 52.41,96.92 U18.3 v1(52.41,86.61) ; 142.41,95.03 U21.3 ; 142.41,95.03 142.41,82.99 142.28,82.85 ; 224.51,12.25 220.56,16.2 ; 224.51,12.25 224.51,10.25 222.58,8.32 U48.3 ; 269.39,93.4 276.99,85.8 v1(276.99,75.71) ; 89.2,69.08 89.2,69.86 90.11,70.78 90.11,77.43 89.79,77.76 ; v1(239.84,102.58) 227.38,115.03 227.38,122.08 228.98,123.68 U15.3 ; 190.52,18.36 190.52,35.19 192.53,37.19 192.53,37.58 ; 190.52,18.36 190.52,17.42 192.99,14.95 192.99,13.67 194.94,11.71 ; 154.63,153.73 U5.3 154.63,155.49 155.55,156.41 155.55,161.33 151.26,165.61 134.75,165.61 124.63,155.49 U4.3 ; U20.3 112.41,94.61 114.12,92.9 ; U7.3 214.63,153.93 214.65,153.91 244.61,153.91 244.63,153.93 244.63,154.43 ; U34.3 40.45,38.75 41.48,39.78 41.48,46.26 40.09,47.64 39.5,47.64 29.2,57.95 29.2,69.86 30.11,70.78 30.11,74.95 27.18,77.88 27.18,80.95 32.39,86.16 ; U40.3 192.53,37.58 ; 114.12,92.9 114.12,80.94 120.22,74.84 120.22,74.13 ; 114.12,92.9 114.81,93.59 114.81,100.52 98.64,116.69 98.64,130.74 97.3,132.08 95.92,132.08 ; 194.94,11.71 194.94,10.68 192.58,8.32 U47.3 ; 194.94,11.71 195.64,12.42 214.84,12.42 218.62,16.2 220.56,16.2 ; 120.22,74.13 120.22,70.89 119.2,69.86 119.2,69.08 ; 120.22,74.13 133.55,74.13 142.28,82.85 ; 64.63,153.93 U2.3 ; 179.2,69.08 179.2,69.86 182.51,73.17 182.51,93.03 179.11,96.43 ; 103.78,19.76 103.78,17.73 103.49,17.44 103.49,9.23 102.58,8.32 U44.3 ; 220.56,16.2 220.56,34.77 222.88,37.09 222.88,37.87 ; 179.11,96.43 178.62,96.92 172.41,96.92 U23.3 ; 179.11,96.43 190.5,107.83 ; 32.39,86.16 23.19,95.36 22.41,95.36 U17.3 ; 32.39,86.16 v1(35.85,89.61) ; v1(272.43,71.88) 272.43,68.3 271.99,67.86 271.99,62.45 271.02,61.48 U35.3 ; 89.79,77.76 85.3,77.76 81.51,73.96 63.3,73.96 59.2,69.86 59.2,69.08 ; v1(258.03,156.01) 264.8,149.24 264.8,136.2 268.83,132.18 v1(268.83,130.48) ; 244.63,154.43 U8.3 ; 244.63,154.43 244.24,154.81 v1(244.24,156.01) ; 95.92,132.08 95.92,152.65 94.63,153.93 U3.3
GND: length 1943.6
  Top Layer w0.254: 294.83,23.07 294.83,23.07 294.83,23.92 ; 294.83,23.07 296,21.91 296,18.45 v1(295.18,17.63) 295.12,17.57 U22.A12 255.51,17.57 v1(254.4,16.47) 246.06,16.47 245.89,16.3 ; 294.83,23.07 U22.A1 ; U8.1 U7.1 U6.1 177.84,163.42 147.96,163.42 U5.1 U4.1 U3.1 U2.1 48.19,163.48 46.31,161.59 43.85,161.59 AUDIO1.1 ; U41.1 185.9,46.63 U40.1 U39.1 U38.1 U37.1 U36.1 63.76,46.36 39.72,46.36 39.34,46.74 U34.1 ; 245.89,16.3 v1(245.89,10.92) ; 245.89,16.3 U49.1 215.88,16.3 ; IC1.13 278.26,132.97 U16.1 231.02,132.97 230.77,133.22 U15.1 ; U29.1 v1(82.47,72.44) ; v1(294.11,26.51) 294.33,26.51 295.03,25.81 295.03,24.12 294.83,23.92 ; 215.88,16.3 U48.1 U47.1 U46.1 U45.1 U44.1 ; 215.88,16.3 v1(215.88,10.92) ; 294.83,23.92 U22.25 ; U11.1 U10.1 U9.1 ; U82.15 260.19,40.1 263.05,40.1 U82.17 ; U20.1 U21.1 ; U23.1 U24.1 U25.1 260.35,104.9 U26.1 ; v1(117.9,130.34) U12.1 U13.1 U14.1 ; U19.1 76.84,103.74 v1(76.84,98.36) ; U28.1 U27.1 ; U42.15 248.68,54.72 248.68,57.26 U42.10 246.14,66.94 255.68,66.94 258.2,69.47 U35.1 271.91,77.09 U81.10 ; U32.1 U31.1 v1(142.47,72.49) ; IC1.38 IC1.3 ; U33.1 v1(215.39,73.69)
  Bottom Layer w0.254: U82.10 268.21,45.58 265.67,45.58 U82.15 258.67,38.99 ; U35.5 265.43,68.33 U35.1 ; IC1.38 296.84,155.11 296.84,144.87 IC1.33 296.84,142.41 296.84,132.16 IC1.28 296.84,129.71 296.84,119.39 IC1.23 ; v1(215.39,73.69) 215.39,71.48 215.62,71.25 U33.5 ; 258.67,38.99 258.67,20.73 v1(254.4,16.47) ; 258.67,38.99 258.67,44.74 U42.15 ; U6.1 179.04,162.33 U6.5 ; U21.5 136.82,103.76 U21.1 135.68,113.75 149.04,127.11 U13.5 149.04,132.33 U13.1 ; U28.1 52.47,74.18 53.61,73.04 U28.5 ; U28.1 45.91,84.41 45.91,97.62 46.82,98.53 U18.5 46.82,100.09 45.68,101.24 U18.1 ; U28.1 59.03,84.41 75.91,84.41 ; U46.1 155.85,12.63 156.99,11.49 U46.5 ; U3.1 89.04,162.33 U3.5 ; 142.81,71.48 142.69,71.36 142.69,59.43 U39.1 156.53,45.59 U39.5 ; 142.81,71.48 142.47,71.82 v1(142.47,72.49) ; 142.81,71.48 143.61,71.48 U31.5 ; U38.5 126.11,45.59 U38.1 ; U34.1 34.86,45.59 U34.5 34.86,40.37 33.95,39.45 33.95,35.54 U43.1 53.19,12.63 54.33,11.49 U43.5 ; U5.5 149.04,162.33 U5.1 ; U24.1 196.82,103.76 U24.5 ; 82.86,71.48 82.86,71.77 82.47,72.16 v1(82.47,72.44) ; 82.86,71.48 83.61,71.48 U29.5 ; 82.86,71.48 82.86,71.28 82.69,71.12 82.69,58.59 U37.1 95.69,45.59 U37.5 ; 75.91,84.41 75.91,97.62 76.82,98.53 ; 75.91,84.41 U29.1 ; U48.1 213.63,18.52 213.63,44.52 215.18,46.06 216.15,46.06 ; U15.1 223.39,132.08 U15.5 ; U47.1 186.99,15.16 U47.5 ; v1(76.84,98.36) 76.82,98.38 76.82,98.53 ; 216.15,46.06 217.3,44.92 U41.5 ; 216.15,46.06 U41.1 ; 294.93,17.57 294.93,16.82 294.83,16.72 U22.26 ; 294.93,17.57 U22.A12 ; 294.93,17.57 294.99,17.63 v1(295.18,17.63) ; AUDIO1.1 43.85,158.53 42.9,158.53 42.76,158.67 29.04,158.67 ; U26.5 262.51,102.74 U26.1 261.15,104.1 261.15,125.24 262.51,126.6 U16.5 262.51,131.83 U16.1 ; U45.1 126.99,15.16 U45.5 ; v1(215.88,10.92) 215.88,10.9 216.08,10.71 U48.5 ; U81.15 U81.16 294.13,69.68 286.73,77.09 U81.10 ; U22.A1 293.65,23.32 293.65,26.05 v1(294.11,26.51) ; U36.5 65.28,45.59 U36.1 ; U33.1 215.39,87.1 226.82,98.53 U25.5 226.82,103.76 U25.1 ; U20.1 106.82,103.76 106.82,98.53 105.88,97.59 105.88,84.44 U30.1 113.61,76.7 U30.5 ; U4.1 119.04,162.33 U4.5 119.04,157.11 117.9,155.97 U12.1 ; U49.5 246.08,10.71 245.89,10.9 v1(245.89,10.92) ; U14.1 179.04,132.33 U14.5 179.04,127.11 165.68,113.75 U23.1 166.82,103.76 U23.5 166.82,98.53 165.91,97.62 165.91,84.41 U32.1 173.61,76.7 U32.5 ; 29.04,158.67 U1.5 29.04,157.11 27.9,155.97 U9.1 29.04,132.33 U9.5 ; 29.04,158.67 29.04,162.33 U1.1 ; IC1.3 281.37,155.25 281.37,150.7 280.66,149.99 279.87,149.99 279.21,149.32 279.21,144.72 IC1.8 279.19,142.54 279.19,132.03 IC1.13 281.38,129.84 281.38,119.33 IC1.18 ; U7.5 209.04,158.67 207.9,159.81 U7.1 ; U44.1 96.99,15.16 96.99,10.71 ; v1(117.9,130.34) 118.13,130.11 118.13,127.89 U12.5 ; 76.82,98.53 U19.5 ; U2.5 59.04,162.33 U2.1 ; U8.1 239.04,162.33 U8.5 ; U10.5 59.04,132.33 U10.1 ; U11.5 89.04,132.33 U11.1 ; U27.5 23.61,76.7 U27.1 15.91,84.41 15.91,97.62 16.82,98.53 U17.5 16.82,103.76 U17.1 ; U40.1 186.94,45.59 U40.5
VCC: length 517.5
  Top Layer w0.254: v1(295.36,20.79) 295.36,20.49 294.93,20.07 U22.A7 ; IC1.39 287.01,169.93 47.3,169.93 47.23,169.86 47.23,166.09 AUDIO1.4 ; U42.17 U42.16 ; U81.9 269.29,79.63 259.54,69.88 246.53,69.88 U42.9
  Bottom Layer w0.254: 270.73,46.61 U82.9 ; 270.73,46.61 266.91,42.79 265.42,42.79 U82.16 ; 270.73,46.61 267.29,50.05 267.29,50.65 259.5,58.43 250.33,58.43 U42.17 U42.9 ; IC1.39 295.36,156.16 295.36,72.01 ; 295.36,72.01 U81.17 U81.9 ; 295.36,72.01 v1(295.36,20.79) 295.14,20.57 U22.B7
B1: length 188.2
  Top Layer w0.254: U81.28 290.53,96.34 271.82,96.34 269.2,98.96 235.54,98.96 234.33,100.17 154.08,100.17 149.49,104.76 138.23,104.76 135.55,107.44 U20.2
B2: length 218.7
  Top Layer w0.254: U19.2 94.97,94.5 268.69,94.5 270.13,95.94 292.66,95.94 U81.27
B3: length 248.7
  Top Layer w0.254: U81.26 292.64,93.37 230.3,93.37 230.21,93.28 229.72,93.28 229.63,93.37 114.43,93.37 114.34,93.28 66.19,93.28 U18.2
B4: length 279.3
  Top Layer w0.254: U81.25 293.01,91.21 38.26,91.21 U17.2
B5: length 67.6
  Top Layer w0.254: U16.2 276.69,135.51 279.86,132.33 v1(288.02,132.33)
  Bottom Layer w0.254: v1(288.02,132.33) 294.16,126.2 294.16,112.42 293.1,111.36 293.1,90.82 U81.24
B6: length 96.3
  Top Layer w0.254: U81.23 293.1,88.28 v1(257.86,88.28)
  Bottom Layer w0.254: U15.2 257.83,106.53 257.83,88.31 v1(257.86,88.28)
B7: length 153.6
  Top Layer w0.254: U14.2 191.91,128.36 264.16,128.36 264.32,128.2 273.22,128.2 274.43,126.98 v1(290.21,126.98)
  Bottom Layer w0.254: U81.22 291.86,86.98 291.86,125.33 v1(290.21,126.98)
B8: length 200.7
  Top Layer w0.254: v1(286.52,103.53) 271.29,118.76 197.37,118.76 181.05,135.07 177.12,135.07 176.51,134.47 149.45,134.47 147.9,136.02 U12.2
  Bottom Layer w0.254: U81.21 290.32,85.98 290.32,99.72 v1(286.52,103.53)
B9: length 207.2
  Top Layer w0.254: U11.2 113.49,116.78 268.65,116.78 285.48,99.95 U81.1
B10: length 299.8
  Top Layer w0.254: U1.2 47.93,152.33 v1(259.48,152.33) ; U81.2 v1(282.24,97.41)
  Bottom Layer w0.254: v1(282.24,97.41) 272.15,107.5 272.15,126.86 269.3,129.71 268.77,129.71 268.24,130.23 268.24,130.91 259.48,139.67 v1(259.48,152.33)
B11: length 272.1
  Top Layer w0.254: v1(92.16,109) 261.29,109 266.54,103.75 271.62,103.75 276.68,98.68 v1(286.9,98.68)
  Bottom Layer w0.254: U2.2 69.24,161.02 69.24,131.92 v1(92.16,109) ; v1(286.9,98.68) 287.54,98.03 287.54,95.9 U81.3
B12: length 248.7
  Top Layer w0.254: U81.4 286.06,92.77 v1(123.24,92.77)
  Bottom Layer w0.254: v1(123.24,92.77) 123.24,101.25 99.24,125.25 99.24,161.02 U3.2
B13: length 248.4
  Top Layer w0.254: U81.5 286.33,89.61 v1(126.29,89.61)
  Bottom Layer w0.254: U4.2 118.11,166.02 115.5,163.4 115.5,113.53 126.29,102.74 v1(126.29,89.61)
B14: length 170.5
  Top Layer w0.254: v1(250.3,88.64) 251.27,87.67 286.09,87.67 U81.6
  Bottom Layer w0.254: v1(250.3,88.64) 235.1,103.84 233.32,103.84 187.43,149.73 187.43,158.67 185.49,160.61 185.49,161.23 180.71,166.02 U5.2
B15: length 141
  Top Layer w0.254: v1(256.88,84.71) U81.7
  Bottom Layer w0.254: v1(256.88,84.71) 239.25,102.33 239.25,102.45 211.37,130.33 211.37,138.9 U6.2
B16: length 143.2
  Top Layer w0.254: U81.8 287.54,83.2 287.54,85.33 286.9,85.98 v1(264,85.98)
  Bottom Layer w0.254: U7.2 240.16,166.02 244.73,161.44 244.73,161.2 258.24,147.7 258.24,91.74 v1(264,85.98)
B17: length 182.2
  Top Layer w0.254: U22.A5 293.89,21.08 v1(291.94,21.08) ; v1(290.9,62.18) v1(282.23,62.18)
  Bottom Layer w0.254: v1(282.23,62.18) 282.23,69.64 258.65,93.23 258.65,151.62 U8.2 ; v1(290.9,62.18) 291.07,62 291.07,39.89 291.97,38.99 ; 292.67,19.57 292.67,18.09 292.09,17.51 291.62,17.51 290.71,18.43 290.71,37.72 291.97,38.99 ; 292.67,19.57 291.94,20.29 v1(291.94,21.08) ; 292.67,19.57 U22.B5 ; 291.97,38.99 U82.28
B18: length 334.1
  Top Layer w0.254: U9.2 35.96,137.73 86.63,137.73 91.02,133.34 96.15,133.34 97.92,131.57 v1(97.92,130.19) ; v1(124.16,41.81) 286.74,41.81 U82.27
  Bottom Layer w0.254: v1(97.92,130.19) 97.92,84.35 98.3,83.97 98.3,67.67 v1(124.16,41.81)
B19: length 301.1
  Top Layer w0.254: v1(282.76,40.94) 285.07,40.94 U82.26 ; v1(65.37,129.6) 80.99,113.97 v1(266.71,113.97)
  Bottom Layer w0.254: U10.2 65.19,135.08 65.19,129.78 v1(65.37,129.6) ; v1(282.76,40.94) 280.79,42.91 280.79,58.09 282.81,60.12 282.81,95.57 266.71,111.67 v1(266.71,113.97)
B20: length 224.1
  Top Layer w0.254: U82.25 282.6,37.1 276.78,37.1 276.51,36.84 172.5,36.84 170.38,38.95 v1(163.21,38.95)
  Bottom Layer w0.254: U13.2 163.05,127.22 163.05,84.85 163.42,84.48 163.42,46.3 163.1,45.99 163.1,39.06 v1(163.21,38.95)
B21: length 206.5
  Top Layer w0.254: v1(193.13,105.73) 167.27,105.73 165.55,107.44 U21.2 ; U82.24 280.46,37.51 276.61,37.51 276.4,37.3 199.34,37.3 v1(195.5,41.14)
  Bottom Layer w0.254: v1(195.5,41.14) 195.92,41.56 195.92,93.67 193.13,96.46 v1(193.13,105.73)
B22: length 191.7
  Top Layer w0.254: U23.2 171.25,108.22 v1(164.98,108.22) ; v1(276.79,36.29) v1(172.22,36.29)
  Bottom Layer w0.254: U82.23 279.4,38.9 v1(276.79,36.29) ; v1(172.22,36.29) 165.7,42.81 165.7,83.37 165.34,83.73 165.34,99.89 165.67,100.22 165.67,102.72 164.07,104.31 164.07,107.31 v1(164.98,108.22)
B23: length 130.8
  Top Layer w0.254: U24.2 225.39,107.44 227.12,105.72 v1(256.79,105.72)
  Bottom Layer w0.254: U82.22 275.82,40.03 275.82,69.89 258.15,87.56 257.61,87.56 256.79,88.38 v1(256.79,105.72)
B24: length 90.2
  Bottom Layer w0.254: U25.2 232.33,107.44 262.23,77.54 267.59,77.54 275.41,69.72 275.41,40.08 U82.21
B25: length 72.9
  Top Layer w0.254: v1(282.12,75.82) 287.17,75.82 v1(288.22,74.76)
  Bottom Layer w0.254: v1(288.22,74.76) 292.1,70.88 U82.1 ; U26.2 282.12,92.02 v1(282.12,75.82)
B26: length 285.3
  Top Layer w0.254: v1(50.93,48.38) 67.85,48.38 68.54,47.69 88.15,47.69 88.81,48.34 98.3,48.34 98.96,47.69 118.23,47.69 118.89,48.34 128.71,48.34 129.47,47.59 153.69,47.59 154.58,48.47 158.29,48.47 159.23,47.54 178.92,47.54 179.71,48.33 189.51,48.33 190.2,47.64 214.51,47.64 215.17,48.3 216.77,48.3 218.42,46.64 230.62,46.64 232.75,44.52 287.47,44.52 U82.2
  Bottom Layer w0.254: v1(50.93,48.38) 50.93,58.27 U27.2
B27: length 243.4
  Top Layer w0.254: U82.3 285.96,45.54 279,45.54 278.13,46.42 278.13,46.97 273.83,51.28 242.41,51.28 240.31,53.38 85.82,53.38 U28.2
B28: length 209.7
  Top Layer w0.254: U29.2 115.41,53.79 240.48,53.79 242.58,51.69 279.41,51.69 U82.4
B29: length 180.9
  Top Layer w0.254: U30.2 127.37,71.83 142.76,71.83 143.85,72.92 150.79,72.92 169.08,54.63 244.17,54.63 246.66,52.14 v1(281.4,52.14)
  Bottom Layer w0.254: v1(281.4,52.14) 281.94,51.6 U82.5
B30: length 166.1
  Top Layer w0.254: v1(153.48,87.26) 252.72,87.26 254.69,85.3 v1(265.55,85.3)
  Bottom Layer w0.254: U31.2 148.82,82.6 v1(153.48,87.26) ; U82.6 279.4,71.44 v1(265.55,85.3)
B31: length 55.4
  Top Layer w0.254: U82.7 274.29,49.17 U41.2
B32: length 83.4
  Top Layer w0.254: U82.8 273.28,47.65 223.81,47.65 223.65,47.48 218.25,47.48 216.46,49.28 U40.2
B33: length 125.4
  Top Layer w0.254: U42.28 248.75,84.8 v1(161.11,84.8)
  Bottom Layer w0.254: v1(161.11,84.8) 161.11,49.9 U39.2
B34: length 155.7
  Top Layer w0.254: v1(238.25,83.19) v1(160.5,83.19) ; v1(159.45,49.61) 131.65,49.61 U38.2
  Bottom Layer w0.254: v1(159.45,49.61) 160.5,50.66 v1(160.5,83.19) ; v1(238.25,83.19) 238.25,83.91 241.78,87.43 246.45,87.43 U42.27
B35: length 188
  Top Layer w0.254: v1(97.72,82.79) 97.89,82.61 248.73,82.61 U42.26
  Bottom Layer w0.254: v1(97.72,82.79) 97.72,52.46 U37.2
B36: length 203.8
  Top Layer w0.254: U42.25 246.6,82.2 88.37,82.2 86.91,80.74 86.91,79.3 83.05,75.44 83.05,72.08 82.5,71.53 v1(82.27,71.53)
  Bottom Layer w0.254: U36.2 70.48,59.74 v1(82.27,71.53)
B37: length 22.1
  Bottom Layer w0.254: U35.2 266.57,76.07 U42.24
B38: length 221.6
  Top Layer w0.254: U34.2 43.59,52.79 v1(221.1,52.79)
  Bottom Layer w0.254: v1(221.1,52.79) 221.1,53.54 242.26,74.7 249.02,74.7 U42.23
B39: length 31.9
  Top Layer w0.254: 221.74,79.38 226.31,74.8 246.38,74.8 U42.22
B40: length 79.4
  Top Layer w0.254: U32.2 178.82,80.24 194.18,64.87 243.18,64.87 246.76,68.45 U42.21
B41: length 213.7
  Top Layer w0.254: v1(191.24,30.13) 70.83,30.13 59.54,18.84
  Bottom Layer w0.254: v1(191.24,30.13) 191.24,33.87 242.57,85.2 U42.1
B42: length 181.6
  Top Layer w0.254: 102.2,18.84 103.75,20.39 v1(201.69,20.39)
  Bottom Layer w0.254: v1(201.69,20.39) 201.69,36.67 242.36,77.34 242.98,77.34 243.67,78.03 243.67,82.59 U42.2
B43: length 142.5
  Top Layer w0.254: v1(191.15,21.52) v1(132.39,21.52)
  Bottom Layer w0.254: v1(191.15,21.52) 191.82,22.19 191.82,30.41 U42.3 ; v1(132.39,21.52) 132.39,19.03 132.2,18.84
B44: length 113.4
  Top Layer w0.254: v1(194.18,19.43) 194.18,18.47 192.89,17.17 191.6,17.17 189.93,18.84 162.2,18.84
  Bottom Layer w0.254: U42.4 194.18,30.23 v1(194.18,19.43)
B45: length 83.6
  Bottom Layer w0.254: 192.2,18.84 201.01,18.84 202.38,20.21 202.38,36.41 242.04,76.07 U42.5
B46: length 63.1
  Bottom Layer w0.254: U42.6 241.06,72.02 241.06,37.7 222.2,18.84
B47: length 57.4
  Bottom Layer w0.254: 252.2,18.84 252.2,45.27 242.84,54.63 242.17,54.63 241.47,55.33 241.47,69.89 U42.7
LED: length 156.3
  Top Layer w0.254: U22.A6 292.72,20.57 v1(292.64,20.49) ; v1(295.98,151.38) 280.42,151.38 IC1.5 ; U22.A9 v1(295.25,19.07)
  Bottom Layer w0.254: 295.25,20.07 U22.B6 292.87,20.07 292.69,20.25 292.69,20.49 ; 295.25,20.07 v1(295.25,19.07) ; 295.25,20.07 295.51,20.07 295.98,20.54 v1(295.98,151.38) ; 292.69,20.49 292.69,21.39 292.87,21.57 U22.B9 ; 292.69,20.49 v1(292.64,20.49)
LEDOUT: length 155.2
  Bottom Layer w0.254: IC1.9 283.35,138.04 283.35,36.66 253.44,6.76 246.99,6.76 ; U49.6 246.99,6.76
RX: length 247
  Top Layer w0.254: AUDIO1.3 48.26,166.87 49.29,166.87 50.05,167.64 248.67,167.64 IC1.11
SCL: length 216.9
  Top Layer w0.254: v1(291.78,23.74) v1(288.18,23.74) ; U22.A10 292.46,18.57 292.01,19.02 v1(288.18,19.02) ; U81.12 272.35,57.85 v1(259.14,57.85) ; R2.1 285.37,141.1 IC1.7
  Bottom Layer w0.254: U42.12 244.08,56.78 253.98,56.78 256.03,54.74 ; IC1.7 283.82,142.65 283.82,73.59 285.4,72.01 ; U22.B10 292.79,22.07 291.78,23.08 v1(291.78,23.74) ; 285.4,72.01 U81.12 ; 285.4,72.01 285.4,51.47 288.18,48.69 v1(288.18,23.74) v1(288.18,19.02) ; v1(259.14,57.85) 256.03,54.74 ; 256.03,54.74 U82.12
SDA: length 211.2
  Top Layer w0.254: U22.A11 291.89,18.07 v1(291.8,18.16) ; U82.13 263.21,45.02 287.08,45.02 288.29,46.22 288.29,47.88 v1(290.45,50.04) v1(293.15,50.04) ; IC1.6 282.54,148.72 285.97,145.29 R1.1
  Bottom Layer w0.254: U42.13 244.08,54.24 253.98,54.24 U82.13 ; 292.66,26.45 292.66,22.78 292.87,22.57 U22.B11 ; 292.66,26.45 291.19,24.98 291.19,18.77 v1(291.8,18.16) ; 292.66,26.45 293.15,26.93 v1(293.15,50.04) ; IC1.6 286.49,142.51 286.49,104.33 285.4,103.24 285.4,76.59 286.18,75.82 286.73,75.82 287.64,74.91 287.64,70.6 U81.13 287.96,68.02 287.96,52.53 v1(290.45,50.04)
TX: length 244.4
  Top Layer w0.254: AUDIO1.2 48.26,159.53 53.64,154.15 259.61,154.15 IC1.12
U1_6: length 47.1
  Top Layer w0.254: v1(29.13,153.18) v1(45.37,153.18)
  Bottom Layer w0.254: v1(45.37,153.18) 57.23,165.04 61.14,165.04 64.63,161.54 U2.4 ; v1(29.13,153.18) 29.04,153.27 U1.6
U2_6: length 40
  Top Layer w0.254: v1(89.64,159.08) 89.12,158.55 59.65,158.55 58.81,157.71 v1(58.81,156.91)
  Bottom Layer w0.254: v1(58.81,156.91) 59.04,156.67 U2.6 ; v1(89.64,159.08) 90.17,158.55 93.97,158.55 U3.4
U3_6: length 62.1
  Bottom Layer w0.254: U4.4 124.63,163.27 125.84,164.48 125.84,166.8 124.92,167.72 89.73,167.72 85.47,163.46 85.47,159.06 89.04,155.49 U3.6
U4_6: length 46.3
  Bottom Layer w0.254: U4.6 119.04,153.93 119.19,153.79 126.06,153.79 137.48,165.21 150.97,165.21 154.63,161.54 U5.4
U5_6: length 56.4
  Top Layer w0.254: v1(175.46,164) 153.72,164 152.7,165.03 146.94,165.03 v1(146.54,164.62)
  Bottom Layer w0.254: v1(175.46,164) 175.46,164.33 176.37,165.24 180.86,165.24 184.63,161.47 U6.4 ; U5.6 149.04,155.49 145.42,159.12 145.42,163.5 v1(146.54,164.62)
U6_6: length 55.9
  Top Layer w0.254: v1(176.61,164.65) 177.06,165.1 178.93,165.1 179.97,164.06 v1(197.03,164.06)
  Bottom Layer w0.254: v1(197.03,164.06) 198,165.03 211.01,165.03 214.63,161.41 U7.4 ; U6.6 179.04,155.49 175.49,159.04 175.49,161.66 176.08,162.25 176.08,164.13 v1(176.61,164.65)
U7_6: length 42
  Bottom Layer w0.254: U7.6 209.04,153.93 209.58,153.39 244.88,153.39 245.55,154.06 245.55,156.19 244.63,157.11 U8.4
U8_6: length 234.8
  Top Layer w0.254: v1(235.2,158.55) v1(98.66,158.55) ; v1(96.53,141.48) v1(36.39,141.48)
  Bottom Layer w0.254: U8.6 239.04,155.49 238.26,155.49 v1(235.2,158.55) ; v1(96.53,141.48) 96.53,156.43 v1(98.66,158.55) ; U9.4 34.63,133.01 36.39,134.77 v1(36.39,141.48)
U9_6: length 46.1
  Bottom Layer w0.254: U10.4 64.63,131.57 61.09,135.11 57.17,135.11 46,123.93 29.04,123.93 ; U9.6 29.04,123.93
U10_6: length 40.9
  Top Layer w0.254: v1(89.88,129.17) 66.63,129.17 65.54,130.25 64.76,130.25 63.05,128.55 59.65,128.55 58.81,127.71 v1(58.81,126.91)
  Bottom Layer w0.254: v1(58.81,126.91) 59.04,126.67 U10.6 ; v1(89.88,129.17) 90.5,128.55 93.97,128.55 U11.4
U11_6: length 60.4
  Top Layer w0.254: v1(87.55,138.55) v1(118.51,138.55)
  Bottom Layer w0.254: v1(118.51,138.55) 124.63,132.43 U12.4 ; v1(87.55,138.55) 85.37,136.37 85.37,129.16 89.04,125.49 U11.6
U12_6: length 46.2
  Bottom Layer w0.254: U12.6 119.04,123.93 119.05,123.92 136,123.92 147.26,135.18 150.95,135.18 154.63,131.51 U13.4
U13_6: length 40.4
  Top Layer w0.254: v1(149.61,122.91) 154.18,122.91 159.82,128.55 183.57,128.55 v1(183.89,128.87)
  Bottom Layer w0.254: v1(183.89,128.87) 184.09,128.67 184.63,128.67 U14.4 ; U13.6 149.04,123.48 v1(149.61,122.91)
U14_6: length 62.8
  Top Layer w0.254: 228.15,118.17 185.58,118.17
  Bottom Layer w0.254: U14.6 179.04,123.93 179.82,123.93 185.58,118.17 ; U15.4 228.98,126.86 229.9,125.93 229.9,119.93 228.15,118.17
  vias: v1(185.58,118.17) v1(228.15,118.17)
U15_6: length 51.9
  Top Layer w0.254: v1(267.77,122.19) v1(225.02,122.19)
  Bottom Layer w0.254: v1(225.02,122.19) 223.53,123.68 223.39,123.68 U15.6 ; v1(267.77,122.19) 269.08,123.5 269.08,125.62 268.1,126.6 U16.4
U16_6: length 260.8
  Top Layer w0.254: v1(28.83,111.12) v1(261.74,111.12)
  Bottom Layer w0.254: U17.4 22.41,104.7 v1(28.83,111.12) ; v1(261.74,111.12) 262.51,111.89 U16.6
U17_6: length 46.6
  Top Layer w0.254: v1(27.89,94.94) v1(16.87,94.94)
  Bottom Layer w0.254: U18.4 52.41,102.89 48.85,106.45 39.41,106.45 v1(27.89,94.94) ; v1(16.87,94.94) 16.82,94.99 U17.6
U18_6: length 39.7
  Top Layer w0.254: v1(58.39,94.94) v1(46.87,94.94)
  Bottom Layer w0.254: v1(58.39,94.94) 63.54,100.09 82.41,100.09 ; v1(46.87,94.94) 46.82,94.99 U18.6 ; U19.4 82.41,100.09
U19_6: length 45
  Top Layer w0.254: v1(114.09,93.87) v1(77.94,93.87)
  Bottom Layer w0.254: v1(114.09,93.87) 114.09,96.85 112.41,98.53 U20.4 ; U19.6 76.82,94.99 v1(77.94,93.87)
U20_6: length 42.7
  Top Layer w0.254: v1(144.03,95.61) 135.74,95.61 135.68,95.67 135.2,95.67 134.7,95.18 v1(107.2,95.18)
  Bottom Layer w0.254: U21.4 142.41,98.53 144.03,96.92 v1(144.03,95.61) ; 106.82,96.14 106.82,95.36 107.02,95.36 v1(107.2,95.18)
U21_6: length 42.9
  Top Layer w0.254: v1(172.53,97.51) 172.53,96.45 171.05,94.97 135.56,94.97 v1(135.44,95.09)
  Bottom Layer w0.254: U23.4 172.41,98.53 172.53,98.41 v1(172.53,97.51) ; v1(135.44,95.09) 136.55,95.09 136.82,95.36 U21.6
U23_6: length 39.9
  Top Layer w0.254: v1(172.08,95.13) 201.21,95.13 202.32,96.24 202.32,97.71
  Bottom Layer w0.254: 202.32,97.71 202.41,97.8 U24.4 ; U23.6 166.82,95.36 167.05,95.13 v1(172.08,95.13)
  vias: v1(202.32,97.71)
U24_6: length 46.2
  Bottom Layer w0.254: U25.4 232.41,102.91 228.82,106.5 224.13,106.5 212.85,95.22 196.96,95.22 196.82,95.36 U24.6
U25_6: length 48.5
  Top Layer w0.254: v1(269,93.99) 268.89,93.87 v1(229.97,93.87)
  Bottom Layer w0.254: v1(269,93.99) 269.18,94.16 269.18,96.43 268.09,97.52 U26.4 ; v1(229.97,93.87) 228.31,93.87 226.82,95.36 U25.6
U26_6: length 247.1
  Top Layer w0.254: v1(29.45,74.03) 51.66,74.03 56.74,79.11 56.74,80.52 66.81,90.6 v1(262.46,90.6)
  Bottom Layer w0.254: v1(29.45,74.03) 29.45,73.29 29.2,73.04 U27.4 ; v1(262.46,90.6) 262.51,90.65 U26.6
U27_6: length 39.6
  Top Layer w0.254: v1(54.45,73.21) 54.39,73.16 24.47,73.16 23.85,72.54 v1(23.85,71.27)
  Bottom Layer w0.254: 23.61,69.08 23.61,71.03 v1(23.85,71.27) ; v1(54.45,73.21) 54.74,72.92 58.54,72.92 U28.4
U28_6: length 39.2
  Bottom Layer w0.254: U29.4 89.2,73.04 89.18,73.05 66.49,73.05 61.6,68.17 53.75,68.17 53.61,68.3 53.61,69.08
U29_6: length 39.6
  Top Layer w0.254: v1(114.45,73.61) v1(97.1,73.61)
  Bottom Layer w0.254: 83.61,68.3 91.79,68.3 v1(97.1,73.61) ; 83.61,69.08 83.61,68.3 ; v1(114.45,73.61) 115.02,73.04 119.2,73.04 U30.4
U30_6: length 39.2
  Bottom Layer w0.254: 113.61,68.3 122.57,68.3 127.37,73.1 149.13,73.1 149.2,73.04 U31.4 ; 113.61,69.08 113.61,68.3
U31_6: length 95.2
  Top Layer w0.254: v1(159.65,52.13) 218.22,52.13 v1(218.58,51.78)
  Bottom Layer w0.254: U41.4 222.88,45.81 218.58,50.12 v1(218.58,51.78) ; 143.61,69.08 143.61,68.17 v1(159.65,52.13)
U32_4: length 46.6
  Top Layer w0.254: v1(206.52,78.24) v1(181.63,78.24)
  Bottom Layer w0.254: 216.53,68.07 216.53,68.85 215.92,68.85 v1(206.52,78.24) ; v1(181.63,78.24) 179.2,75.81 U32.4
U32_6: length 160.5
  Top Layer w0.254: v1(163.38,24.02) v1(70.26,24.02)
  Bottom Layer w0.254: 173.61,69.08 173.61,34.26 v1(163.38,24.02) ; U43.4 60.83,10.71 60.83,14.6 v1(70.26,24.02)
U33_4: length 221.4
  Top Layer w0.254: v1(217.72,83.78) 80.76,83.78 v1(69.41,72.43)
  Bottom Layer w0.254: 34.86,37.19 41.23,37.19 69.41,65.37 v1(69.41,72.43) ; v1(217.72,83.78) 217.72,79.26 222.12,74.85 U33.4 ; U34.6 34.86,37.19
U34_4: length 250
  Top Layer w0.254: 39.96,46.94 43.85,50.83 218.13,50.83 218.17,50.79 225.09,50.79 226.15,49.74 269.31,49.74 v1(269.36,49.78)
  Bottom Layer w0.254: U34.4 40.45,41.93 39.96,42.41 39.96,46.94 ; v1(269.36,49.78) 265.43,53.71 U35.6
  vias: v1(39.96,46.94)
U35_4: length 255.5
  Top Layer w0.254: v1(66.17,51.47) 218.06,51.47 218.33,51.19 227.39,51.19 228.26,50.32 v1(267.88,50.32)
  Bottom Layer w0.254: U35.4 271.02,67.54 267.52,71.03 263.62,71.03 261.75,69.17 261.75,56.77 267.88,50.65 v1(267.88,50.32) ; U36.6 65.28,38.75 61.69,42.34 61.69,47 v1(66.17,51.47)
U36_4: length 26.6
  Bottom Layer w0.254: U36.4 70.87,40.37 73.26,37.97 U37.6
U37_4: length 26.6
  Bottom Layer w0.254: U38.6 103.68,37.97 101.28,40.37 U37.4
U38_4: length 26.6
  Bottom Layer w0.254: U38.4 131.7,40.37 134.09,37.97 U39.6
U39_4: length 26.8
  Top Layer w0.254: v1(162.13,40.04) v1(174.2,40.04)
  Bottom Layer w0.254: U40.6 176.27,37.97 v1(174.2,40.04) ; v1(162.13,40.04) 162.12,40.06 U39.4
U40_4: length 30
  Top Layer w0.254: v1(194.27,42.88) v1(215.67,42.88)
  Bottom Layer w0.254: v1(215.67,42.88) 215.67,40.28 217.3,38.65 217.3,37.87 ; v1(194.27,42.88) 193.31,41.93 192.53,41.93 U40.4
U43_6: length 58.8
  Bottom Layer w0.254: 54.33,6.76 62.79,6.76 74.05,18.01 98.76,18.01 102.58,14.2 U44.4 ; U43.6 54.33,6.76
U44_6: length 46.1
  Bottom Layer w0.254: U45.4 132.58,14.26 128.83,18 116.62,18 105.38,6.76 96.99,6.76 ; 96.99,7.54 96.99,6.76
U45_6: length 46
  Bottom Layer w0.254: U45.6 126.99,6.76 ; 126.99,6.76 135.38,6.76 146.49,17.87 158.91,17.87 162.58,14.2 162.58,10.71
U46_6: length 46.1
  Bottom Layer w0.254: U46.6 156.99,6.76 ; 156.99,6.76 165.38,6.76 176.55,17.93 189.04,17.93 192.58,14.39 U47.4
U47_6: length 39.1
  Bottom Layer w0.254: U47.6 186.99,6.76 ; 186.99,6.76 197.26,6.76 202.01,11.51 222.56,11.51 222.58,11.49 U48.4
U48_6: length 39.1
  Bottom Layer w0.254: U48.6 216.99,6.76 ; U49.4 252.58,11.49 252.56,11.51 232.01,11.51 227.26,6.76 216.99,6.76

## Copper pours and planes (outline as drawn; the poured copper is in the pictures)
GND on Top Layer: -14.61,189.99 322.96,189.99 323.6,189.36 323.6,3.56 312.93,-7.11 -11.94,-7.11
GND on Bottom Layer: -13.97,184.66 313.69,184.66 315.6,182.75 315.6,-9.14 312.93,-11.81 -7.87,-11.81 -12.57,-7.11
